# EasyEDA Pro project OURphone_PCB_2026-01-30.epro, schematic OURS PHONE_CONNECTORS_FLIP_2

## Sheets
1 CONNECTORS: Board Name: OURS PHONE_CONNECTORS_FLIP_2; Create Date: 2025-07-15; Page Name: CONNECTORS; Project Name: BackupProjects_abdulrehmanbinafsar_personal_0_20241230; Schematic Name: OURS PHONE_CONNECTORS_FLIP_2; Update Date: 2025-12-22; Add into BOM: yes; Company: Your Company; Convert to PCB: yes; Date: 2024-12-04; Draw By: Abdul Rehman; REV: 1.0; Sheet: 1/1
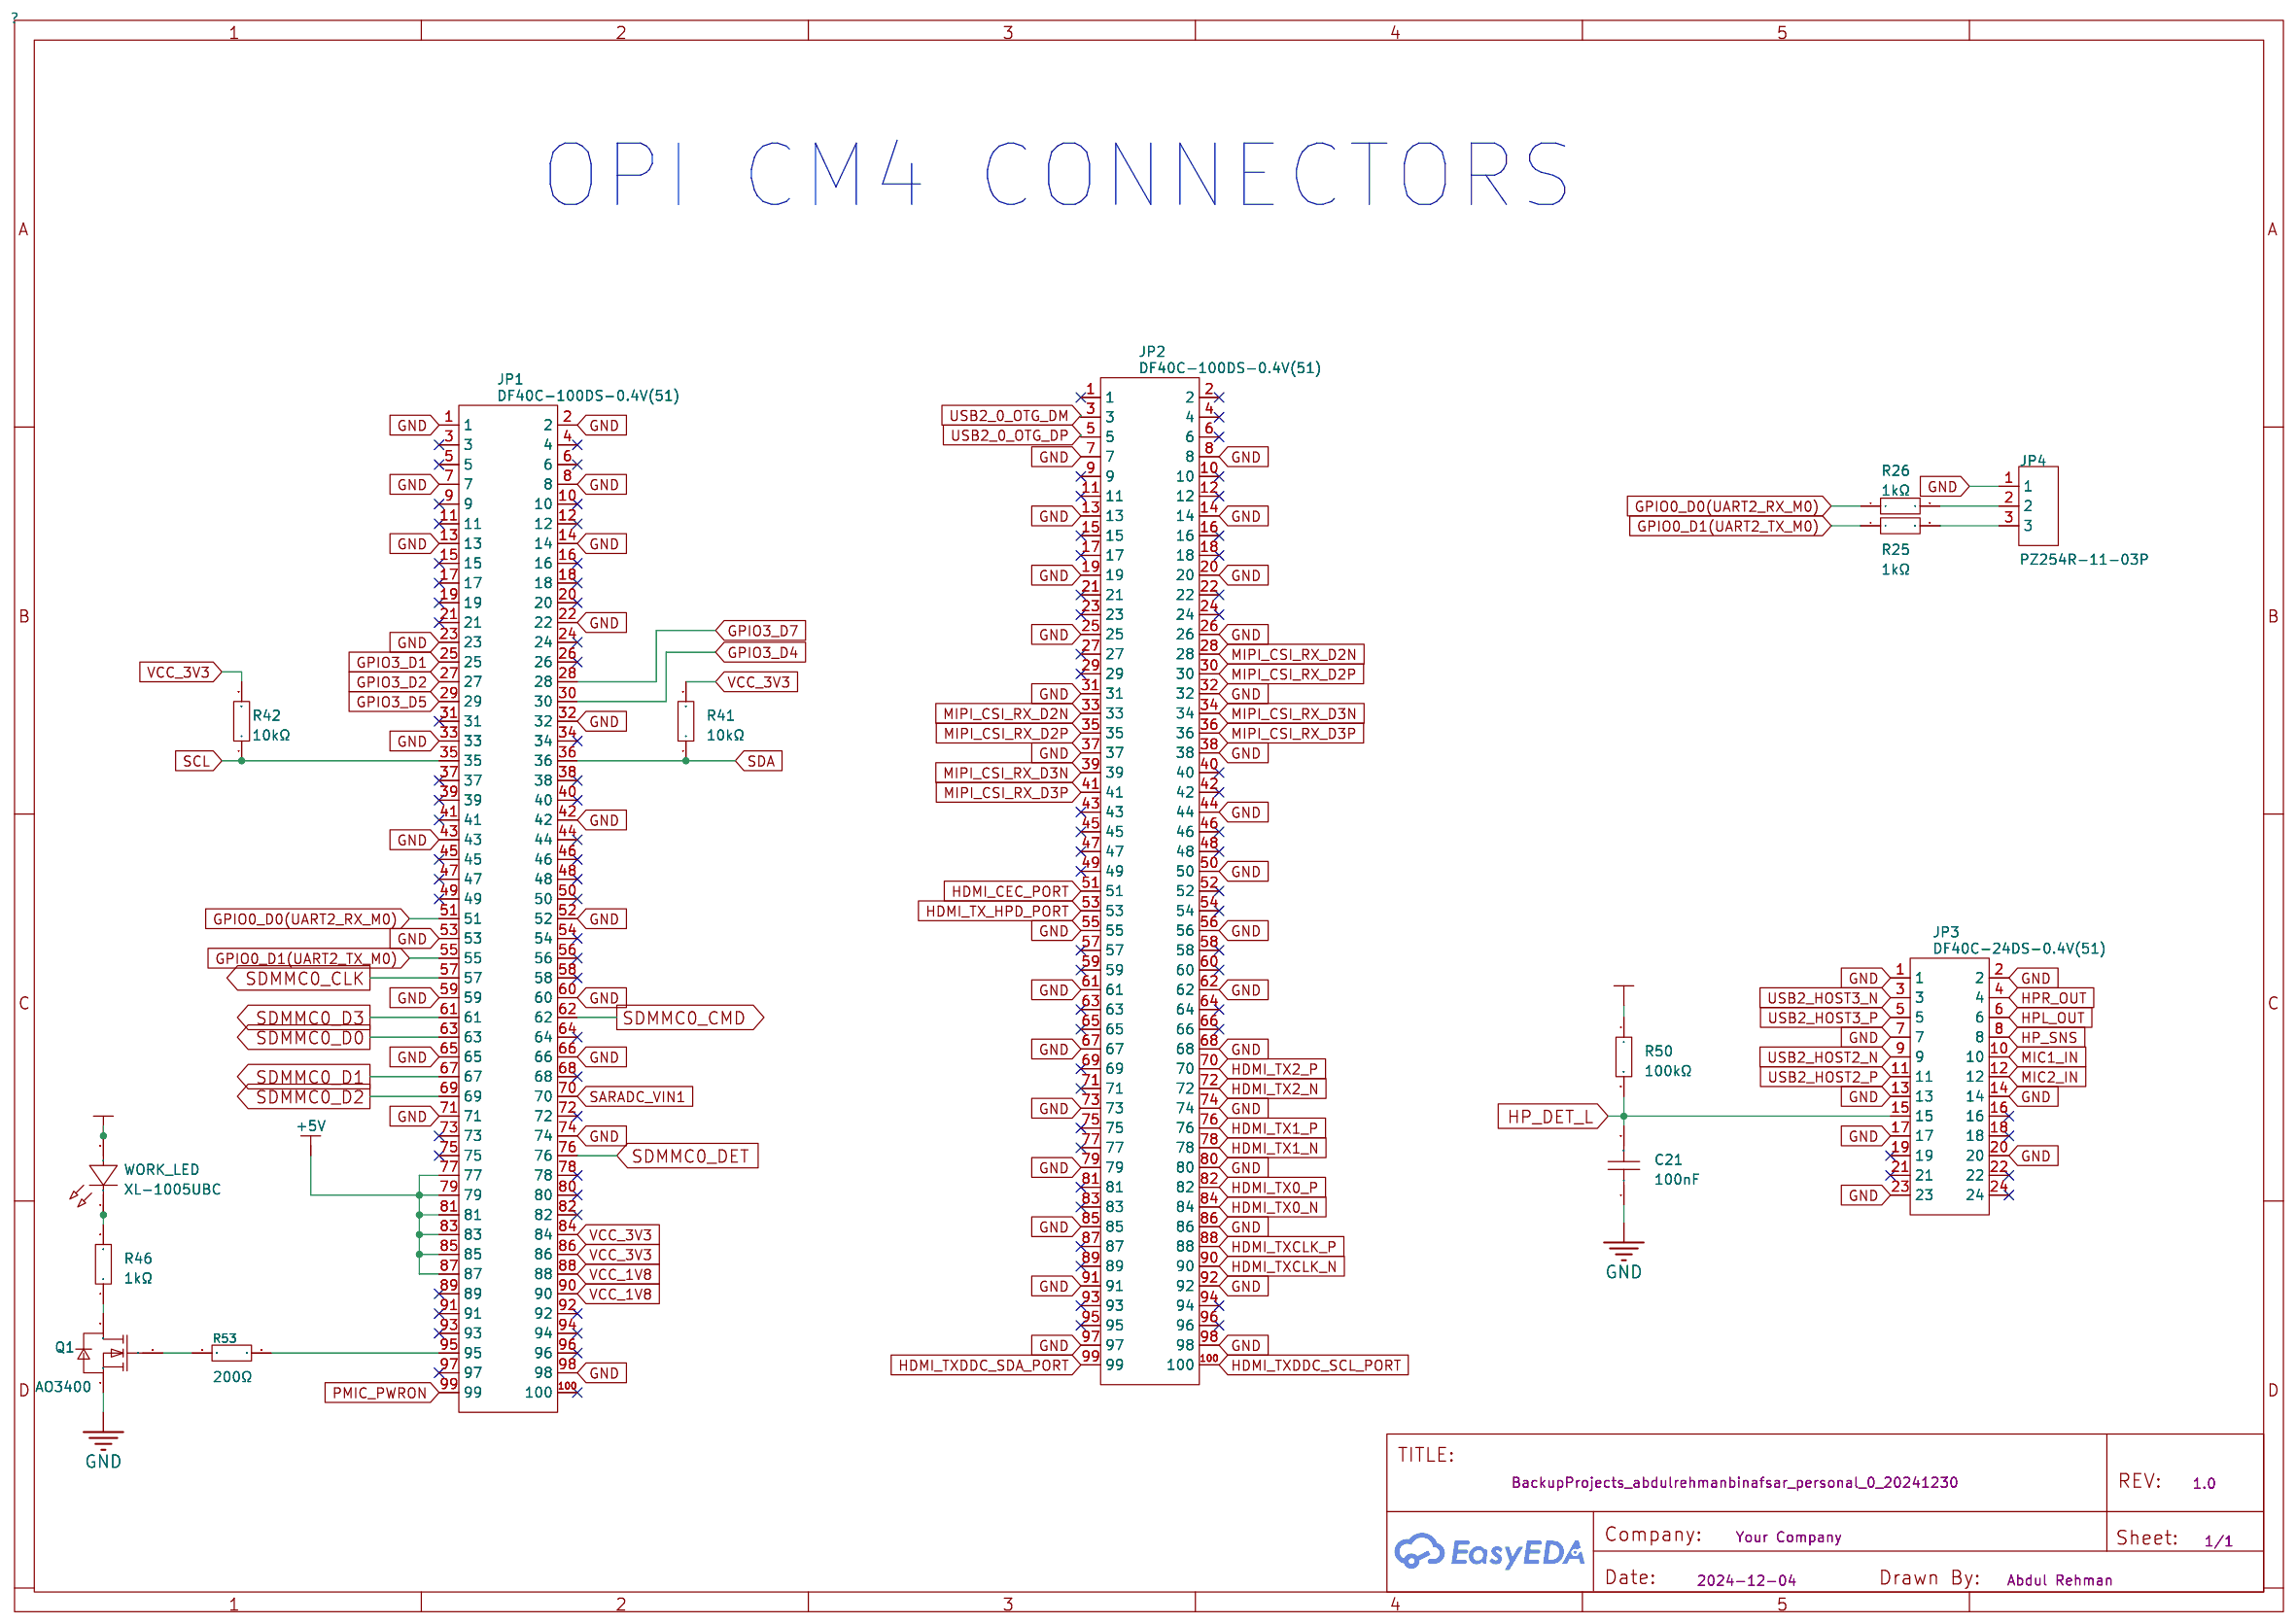
[diagram p0: CONNECTORS]
2 CIRCUITRY: Page Name: CIRCUITRY; Date: 2024-12-06
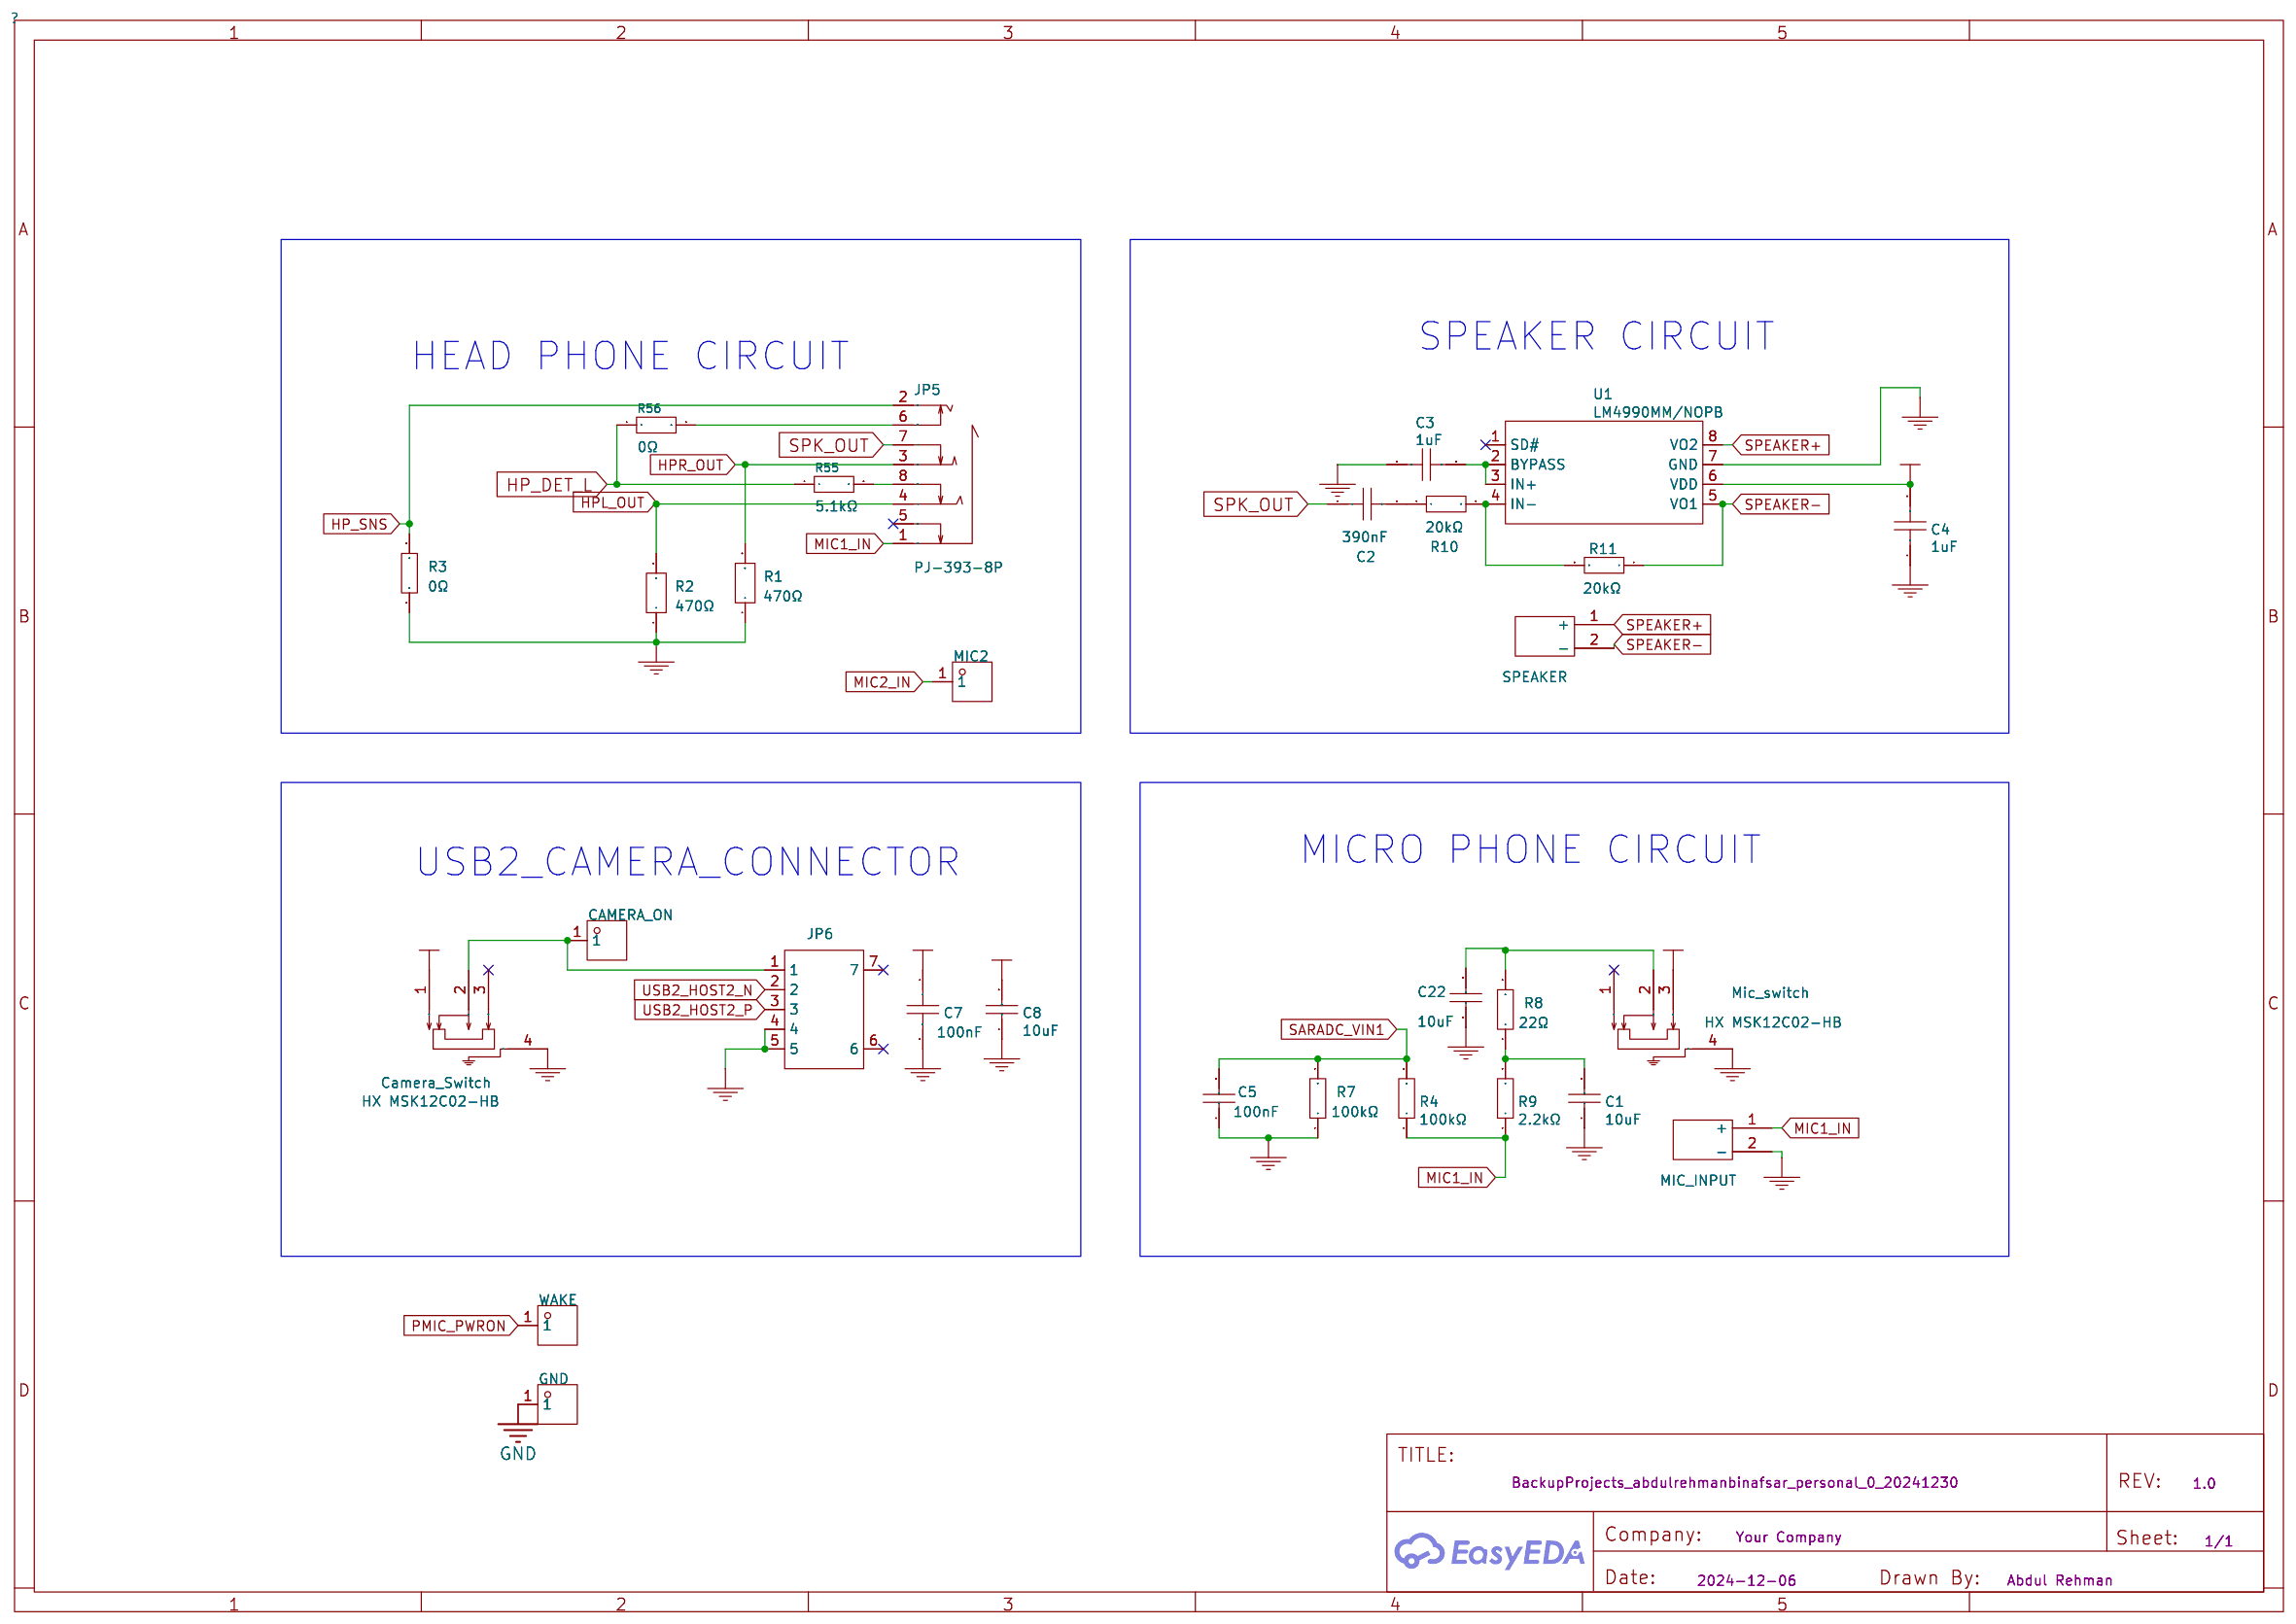
[diagram p1: CIRCUITRY]
3 SIM Module: Page Name: SIM Module; Date: 2024-12-06
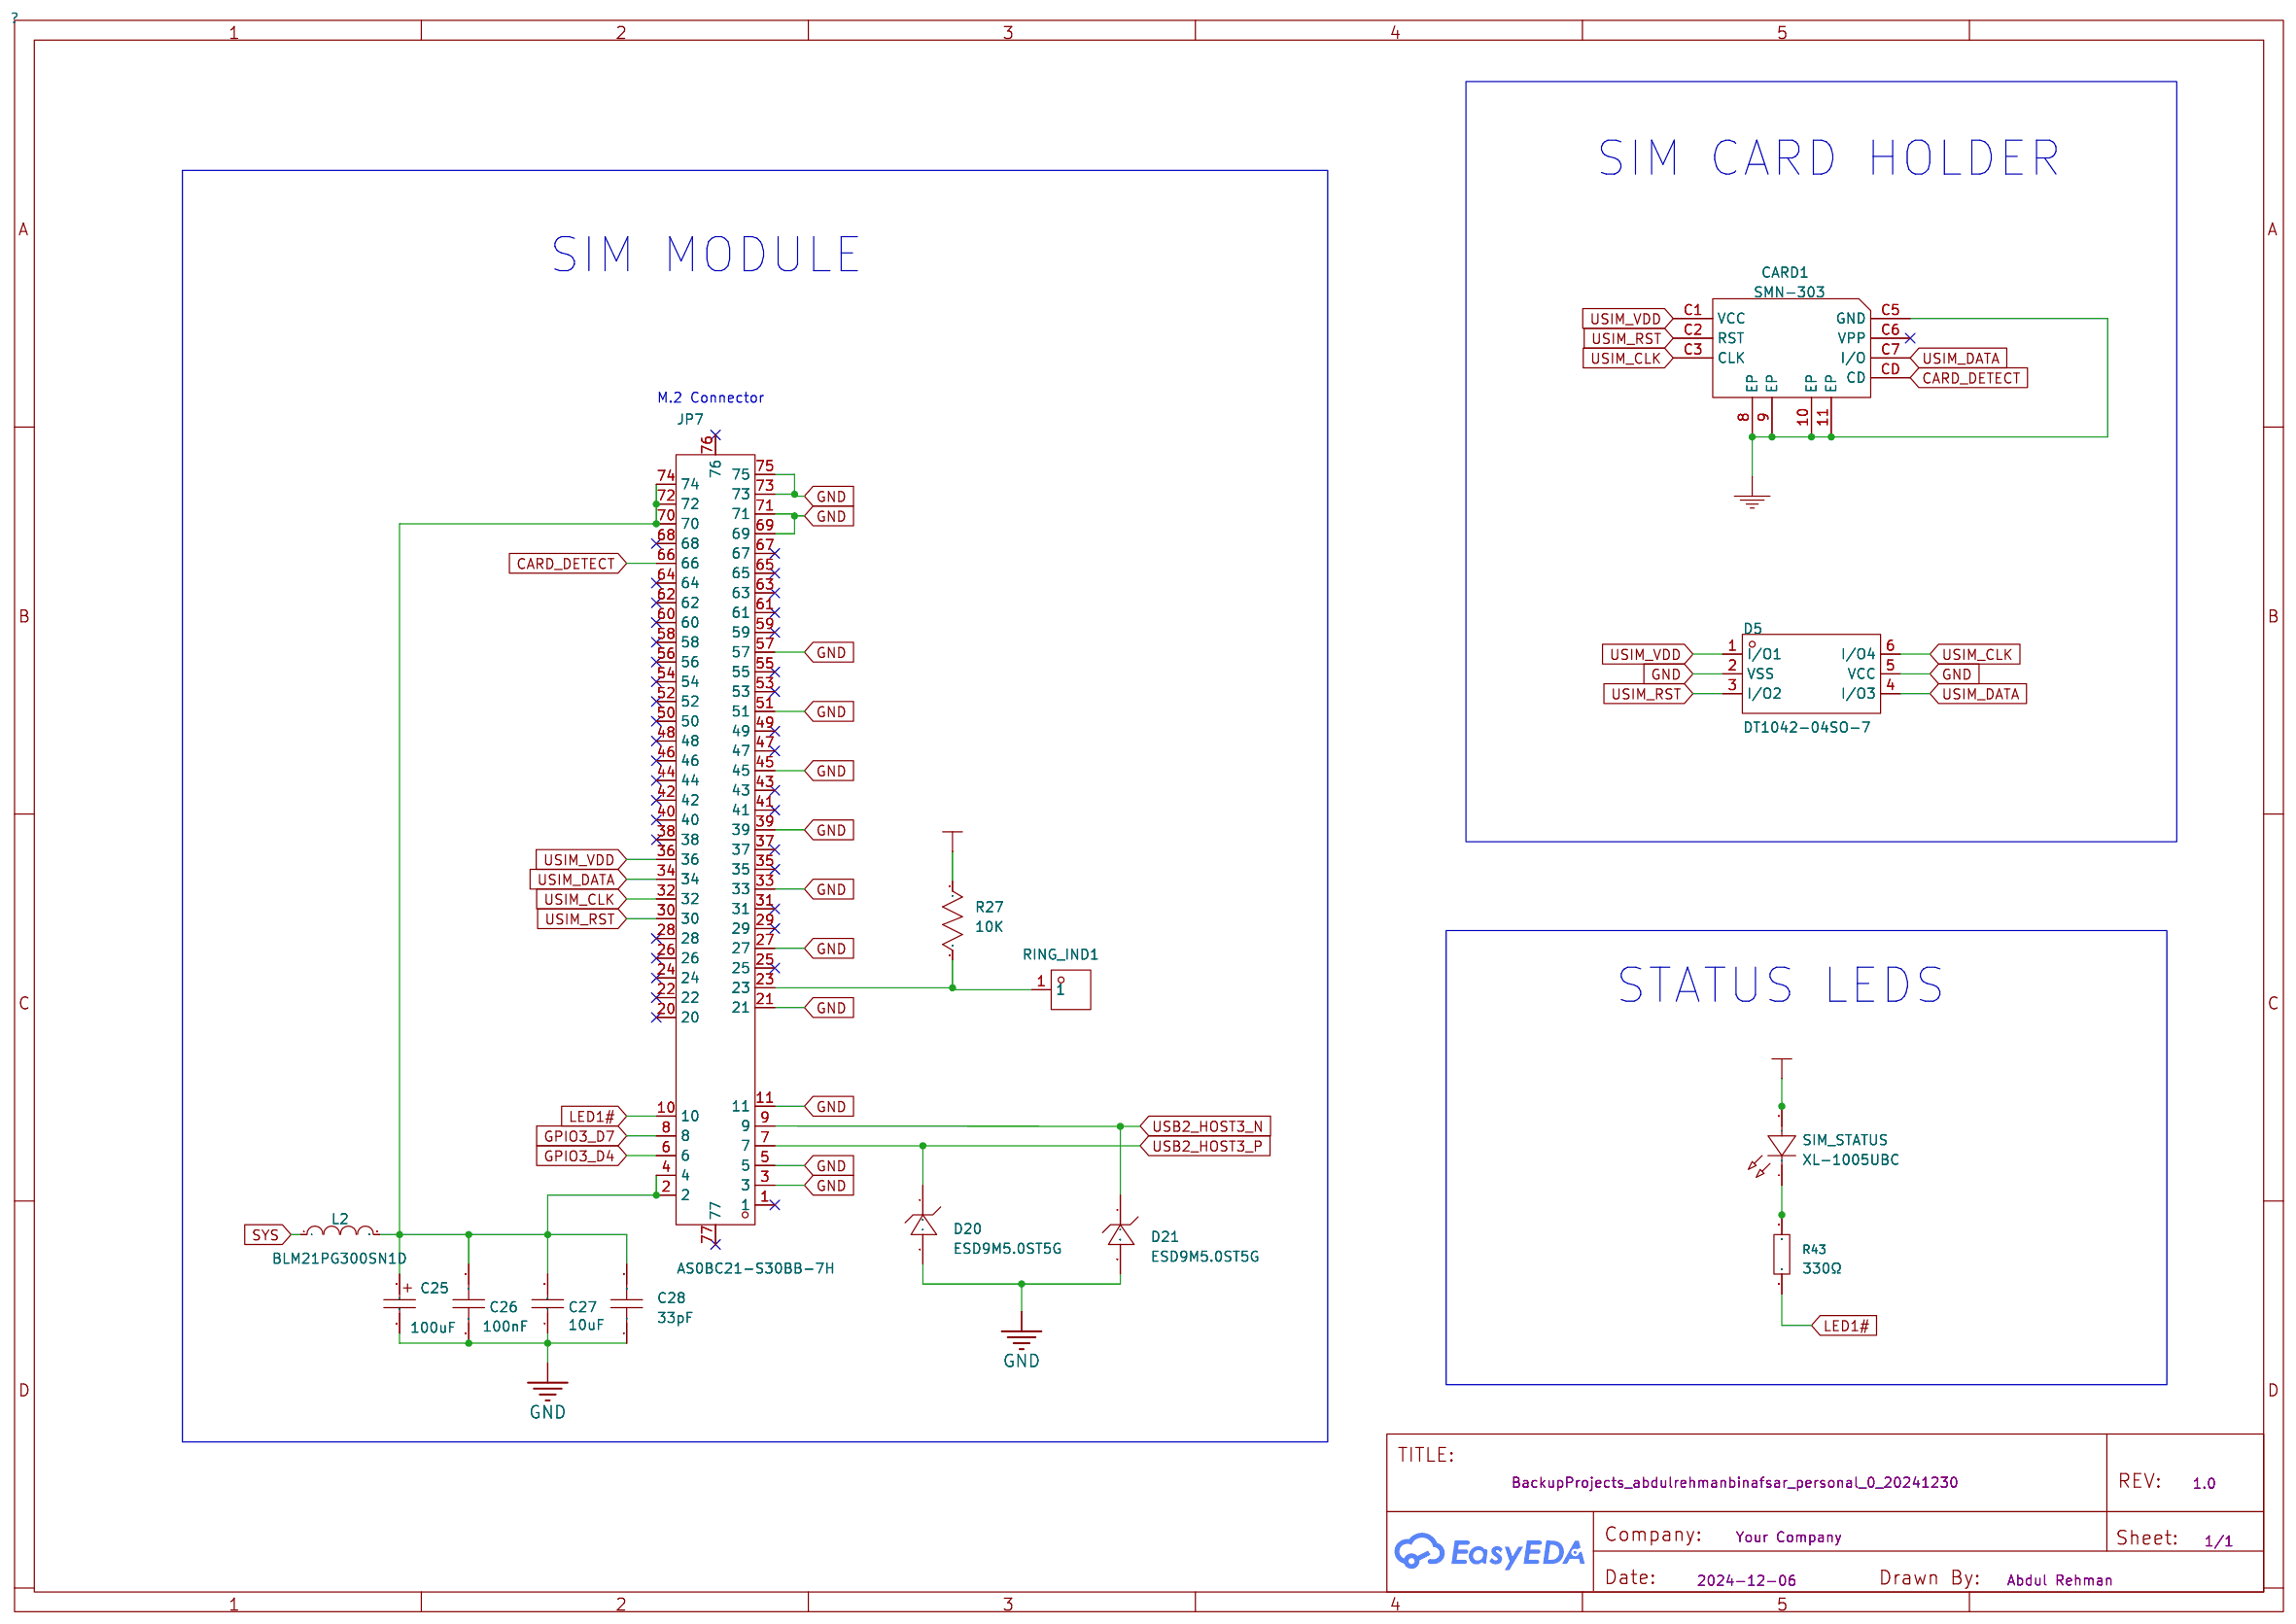
[diagram p2: SIM Module]
4 HDMI PORT: Page Name: HDMI PORT; Update Date: 2025-12-10; Date: 2024-12-09
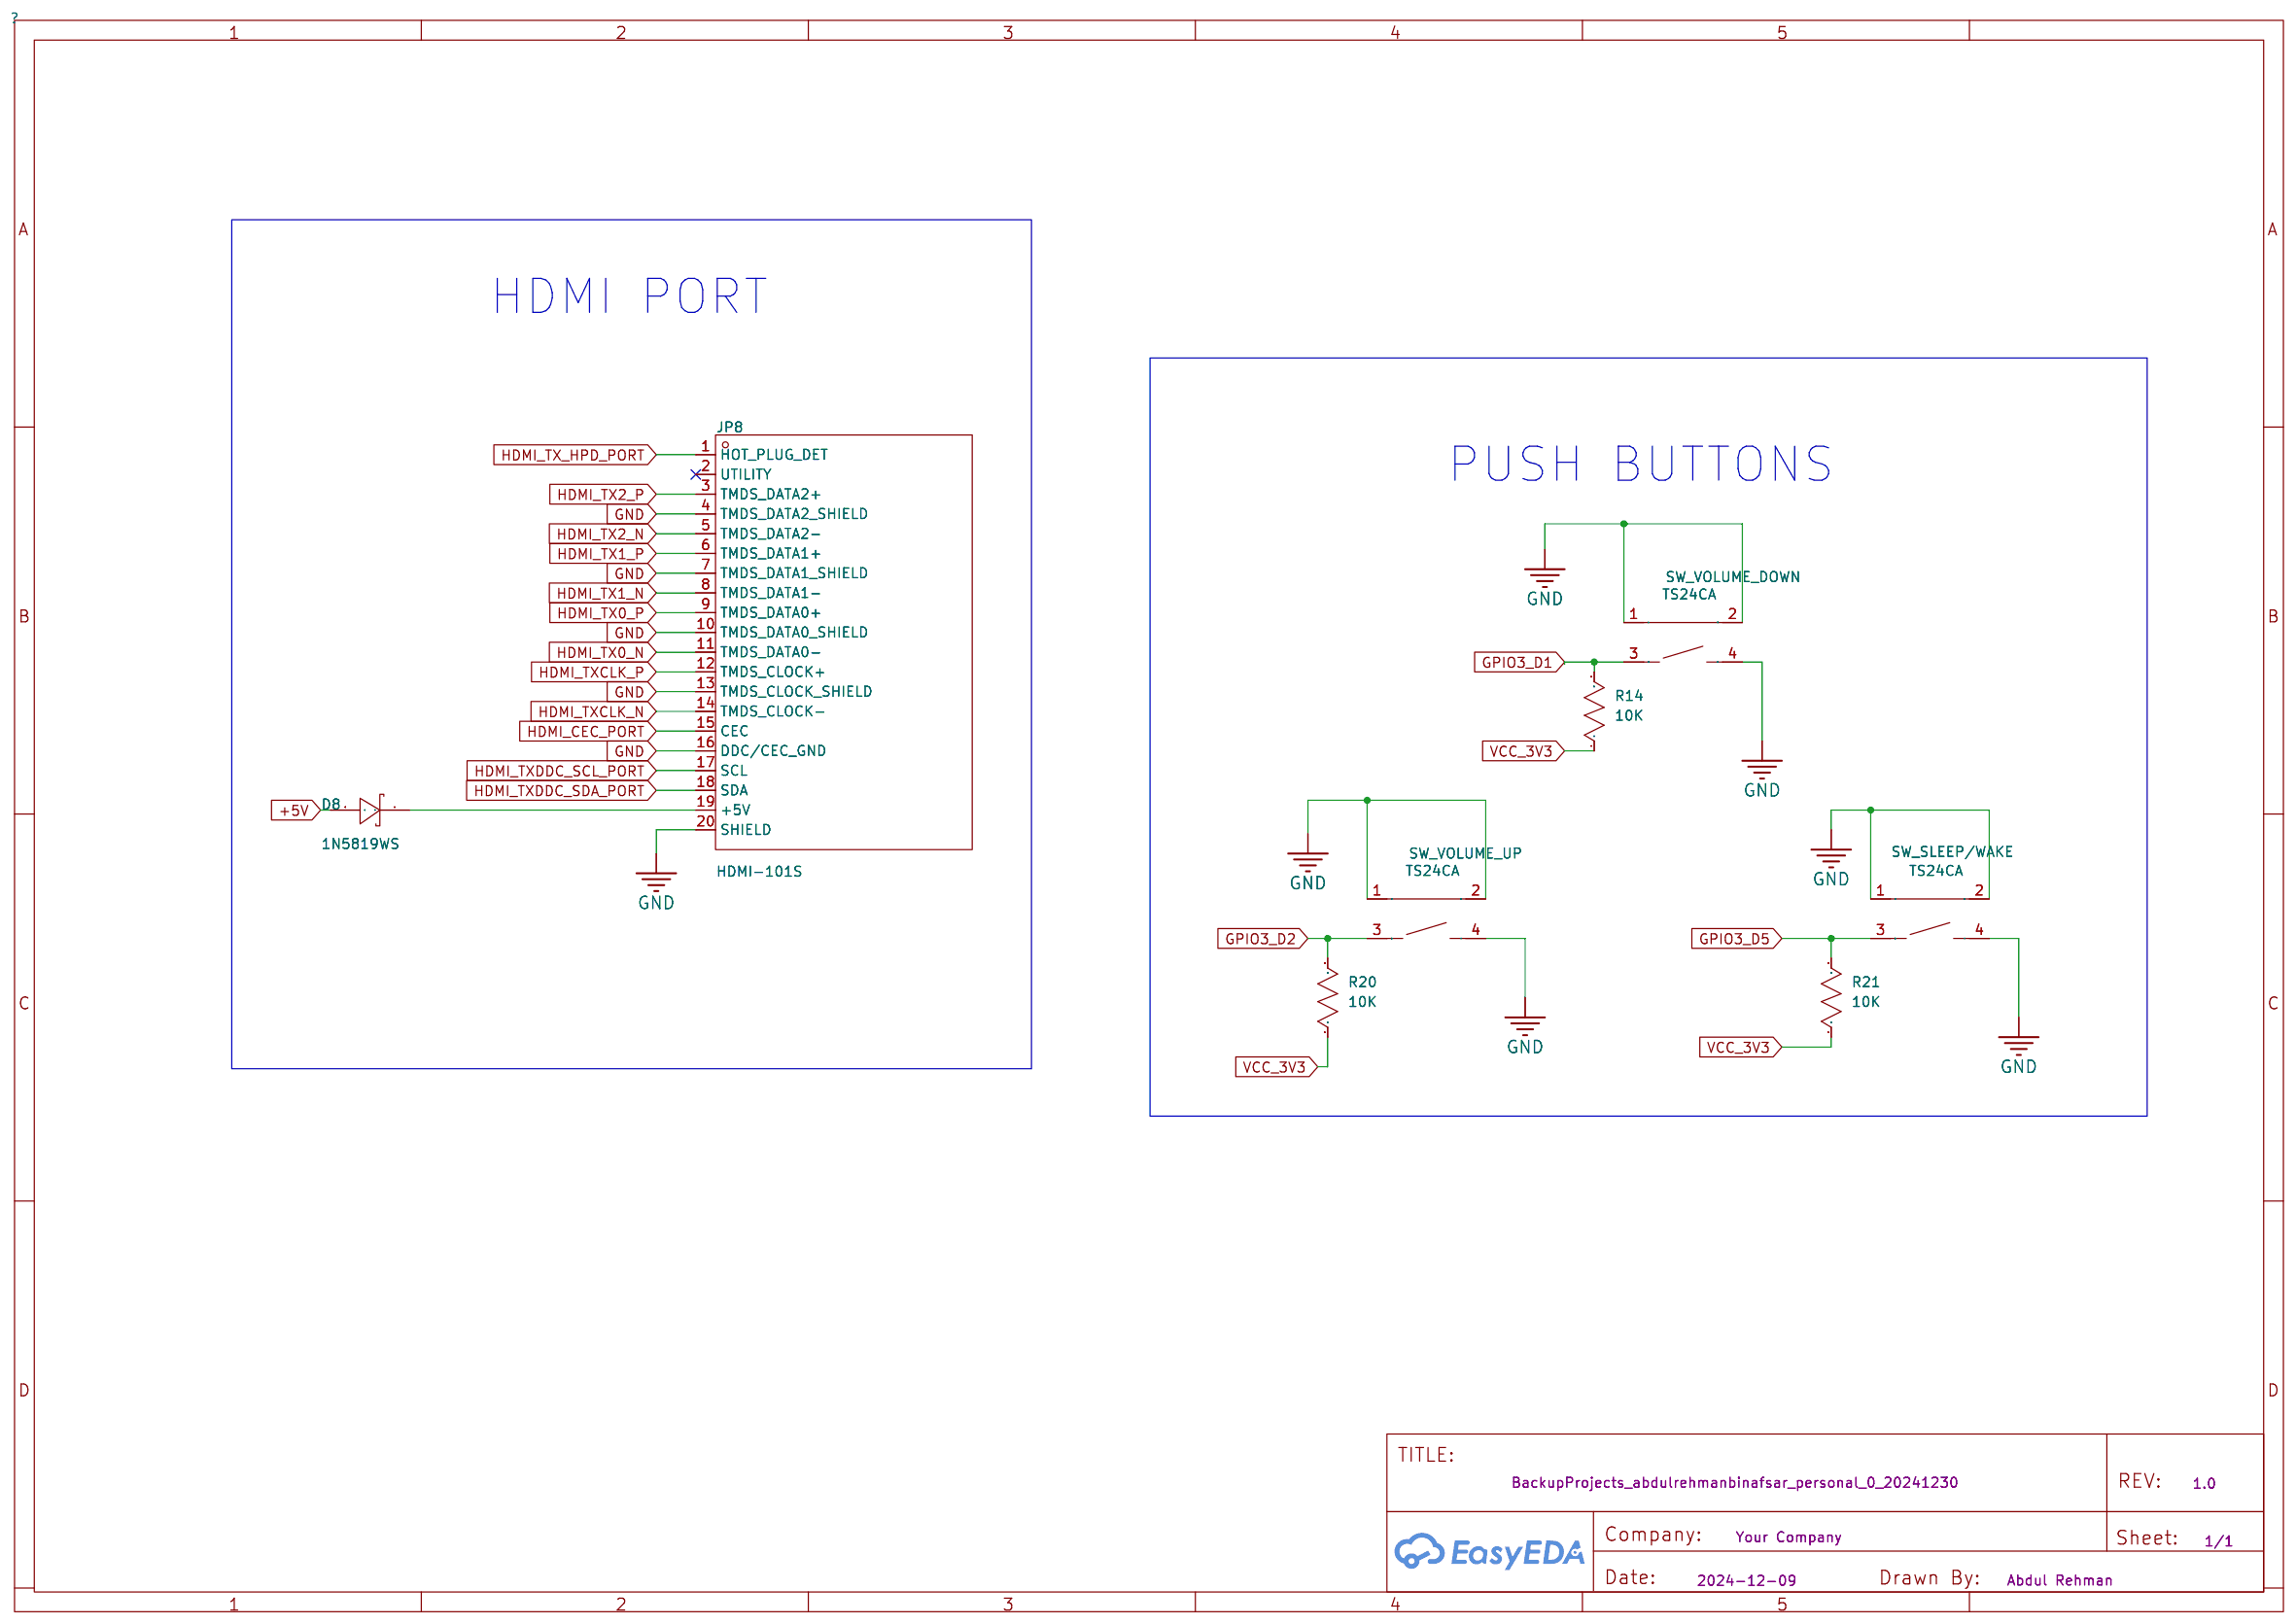
[diagram p3: HDMI PORT]
5 CPBR CIRCUIT: Page Name: CPBR CIRCUIT; Update Date: 2025-12-11; Company: EasyEDA.com; Page Size: A4; Version: V1.0
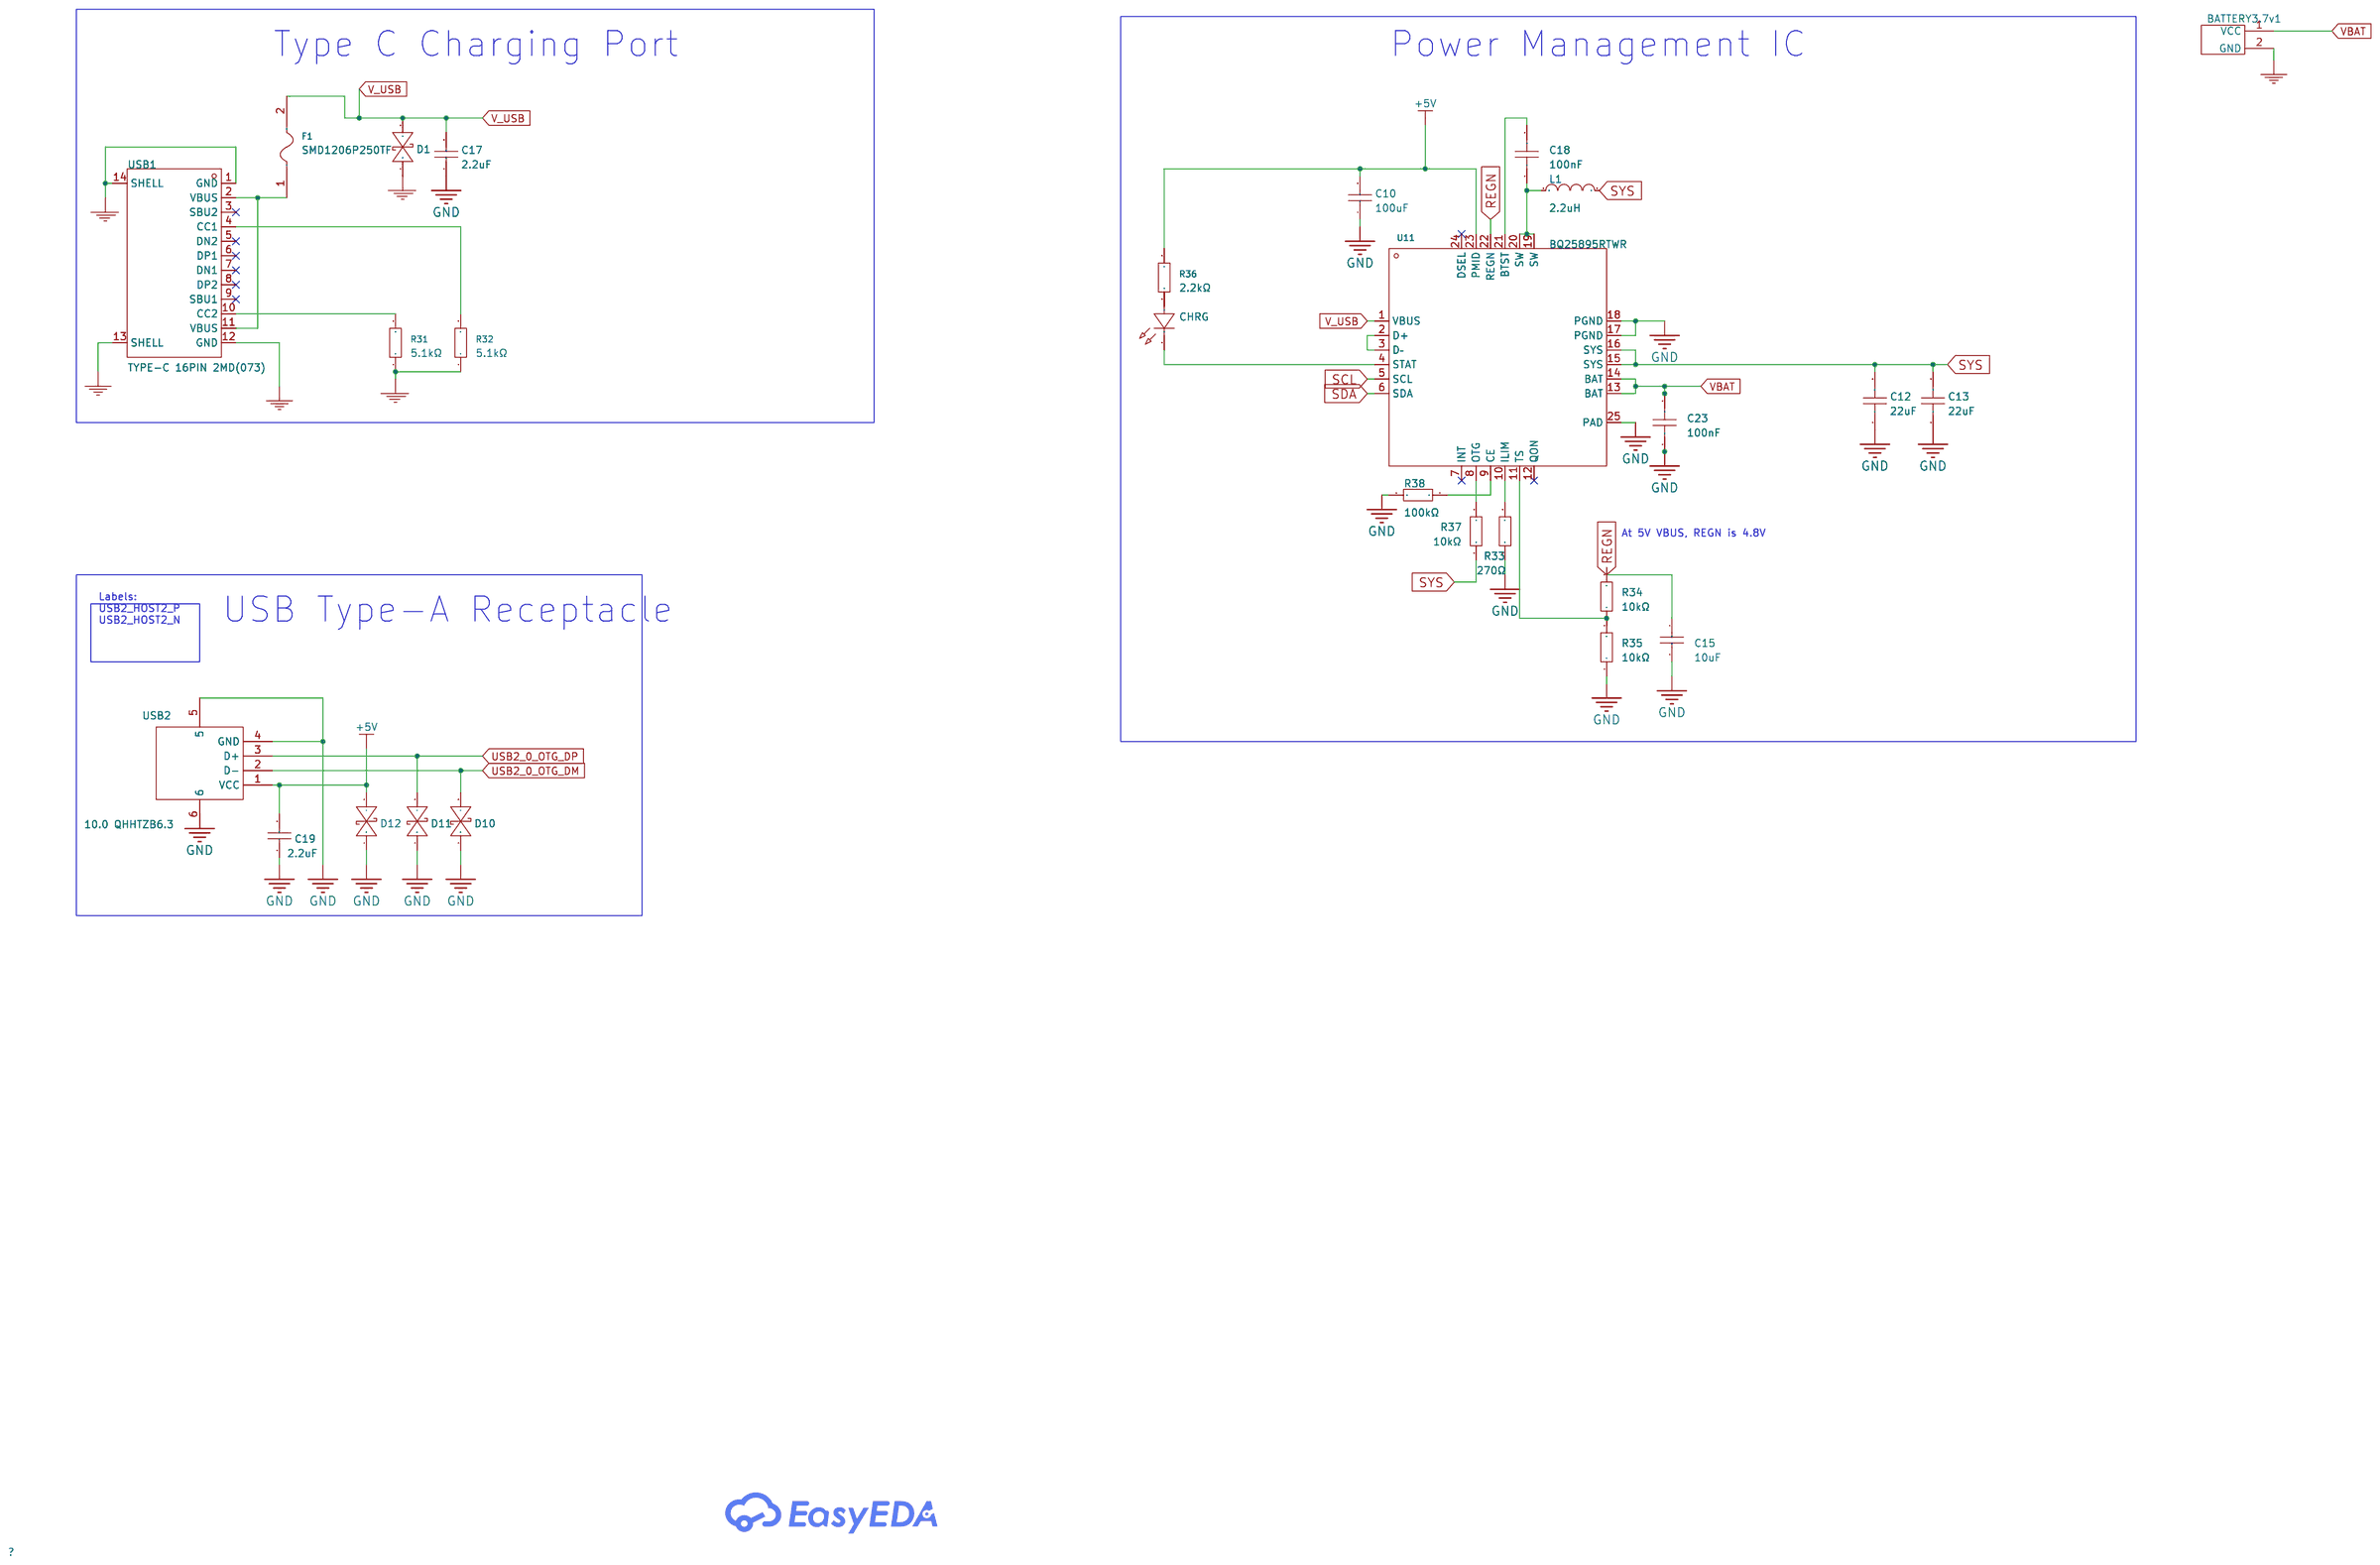
[diagram p4: CPBR CIRCUIT]
6 SD Card: Create Date: 2025-11-14; Page Name: SD Card; Update Date: 2025-12-19; Company: EasyEDA.com; Page Size: A4; Version: V1.0
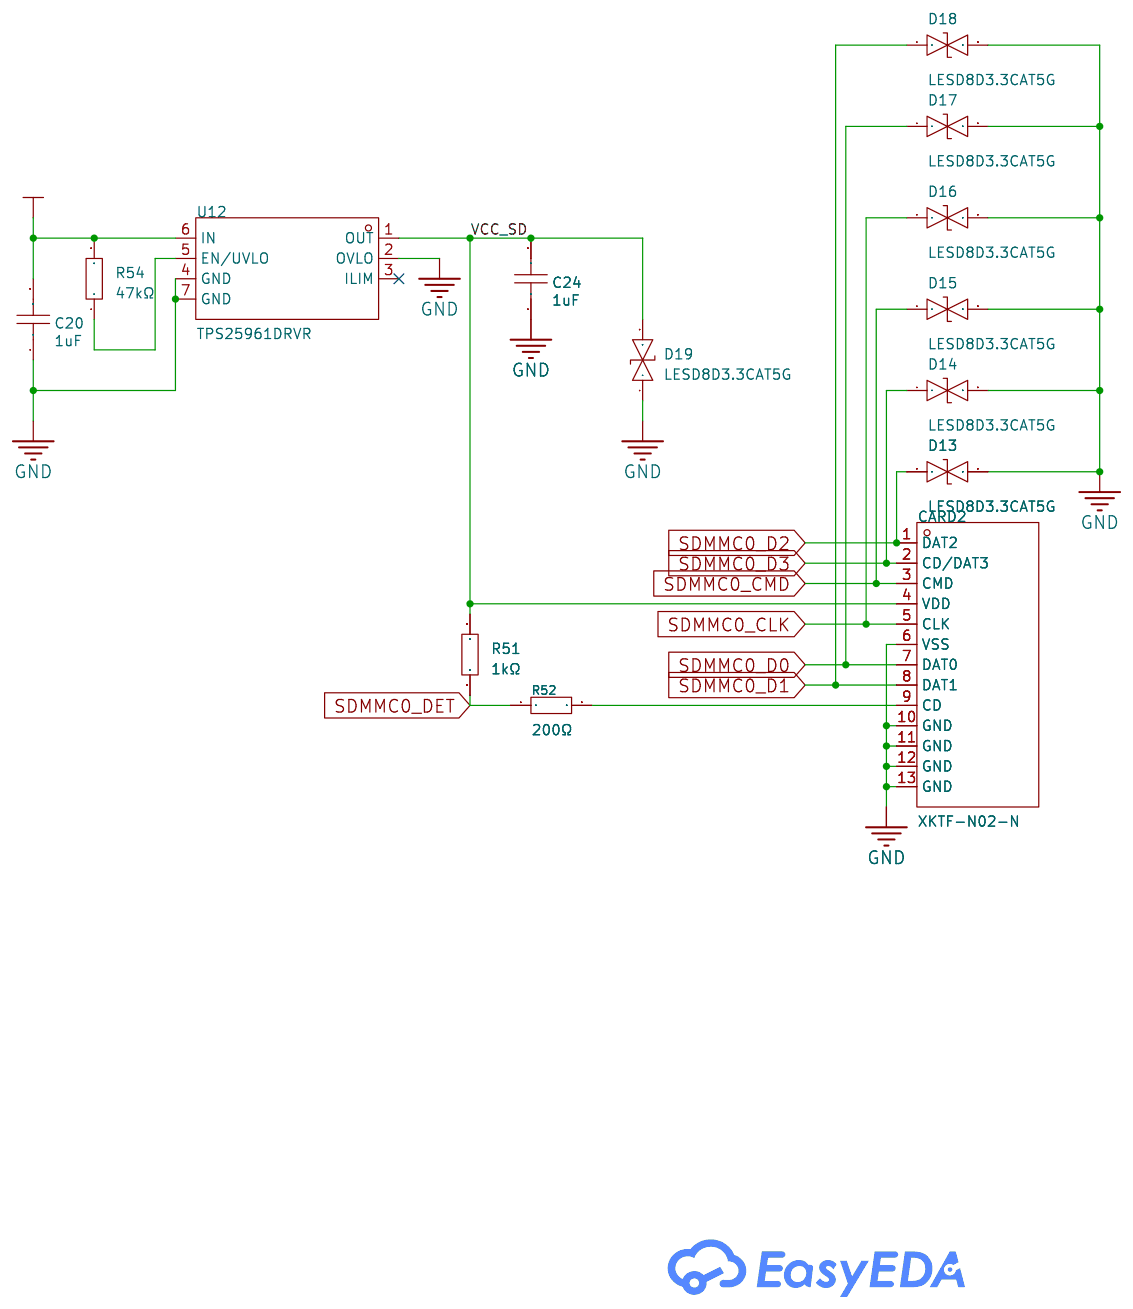
[diagram p5: SD Card]

## Parts
sheet CIRCUITRY
C1  10uF  [C0402]
C2  390nF  [C0402]
C3  1uF  [C0402]
C4  1uF  [C0402]
C5  100nF  [C0402]
C7  100nF  [C0402]
C8  10uF  [C0402]
C22  10uF  [C0402]
CAMERA_ON  TP-橘色测试点  [TESTPOINT-TH_BD3.2]  (no BOM)
Camera_Switch  HX MSK12C02-HB  [SW-SMD_MSK12C02-HB]
GND  TP-橘色测试点  [TESTPOINT-TH_BD3.2]  (no BOM)
JP5  PJ-393-8P  [AUDIO-TH_PJ-393-8P]
JP6  SM05B-SRSS-TB (LF)(SN)  [CONN-SMD_SM05B-SRSS-TB-LF-SN]
MIC2  TP-橘色测试点  [TESTPOINT-TH_BD3.2]  (no BOM)
MIC_INPUT  NOB  [BATTERY SYMBOL]  (no BOM)
Mic_switch  HX MSK12C02-HB  [SW-SMD_MSK12C02-HB]
R1  470Ω  [R0402]
R2  470Ω  [R0402]
R3  0Ω  [R0402]
R4  100kΩ  [R0402]
R7  100kΩ  [R0402]
R8  22Ω  [R0402]
R9  2.2kΩ  [R0402]
R10  20kΩ  [R0402]
R11  20kΩ  [R0402]
R55  5.1kΩ  [R0402]
R56  0Ω  [R0402]  (no BOM)
SPEAKER  NOB  [BATTERY SYMBOL]  (no BOM)
U1  LM4990MM/NOPB  [MSOP-8_L3.0-W3.0-P0.65-LS5.0-BL]
WAKE  TP-橘色测试点  [TESTPOINT-TH_BD3.2]  (no BOM)
sheet CONNECTORS
C21  100nF  [C0402]
JP1  DF40C-100DS-0.4V(51)  [CONN-SMD_DF40C-100DS-0.4V-51]
JP2  DF40C-100DS-0.4V(51)  [CONN-SMD_DF40C-100DS-0.4V-51]
JP3  DF40C-24DS-0.4V(51)  [CONN-SMD_DF40C-24DS-0.4V51]
JP4  PZ254R-11-03P  [HDR-TH_3P-P2.54-H-M-W10.4]
Q1  AO3400  [SOT-23-3_L2.9-W1.3-P1.90-LS2.4-BR]
R25  1kΩ  [R0603]
R26  1kΩ  [R0603]
R41  10kΩ  [R0402]
R42  10kΩ  [R0402]
R46  1kΩ  [R0603]
R50  100kΩ  [R0402]
R53  200Ω  [R0402]
WORK_LED  XL-1005UBC  [LED0402-RD]
sheet CPBR CIRCUIT
BATTERY3.7v1  NOB  [BATTERY SYMBOL]  (no BOM)
C10  100uF  [C1206]
C12  22uF  [C0805]
C13  22uF  [C0805]
C15  10uF  [C0402]
C17  2.2uF  [C0805]
C18  100nF  [C0402]
C19  2.2uF  [C0805]
C23  100nF  [C0402]
CHRG  XL-1005UGC  [LED0402-RD_GREEN]
D1  AZ5825-01F  [DFN-2L_L1.0-W0.6-P0.65-BI]
D10  AZ5825-01F  [DFN-2L_L1.0-W0.6-P0.65-BI]
D11  AZ5825-01F  [DFN-2L_L1.0-W0.6-P0.65-BI]
D12  AZ5825-01F  [DFN-2L_L1.0-W0.6-P0.65-BI]
F1  SMD1206P250TF  [F1206]
L1  2.2uH  [IND-SMD_L4.4-W4.2]
R31  5.1kΩ  [R0402]
R32  5.1kΩ  [R0402]
R33  270Ω  [R0402]
R34  10kΩ  [R0402]
R35  10kΩ  [R0402]
R36  2.2kΩ  [R0402]
R37  10kΩ  [R0402]
R38  100kΩ  [R0402]
U11  BQ25895RTWR  [QFN-24_L4.0-W4.0-P0.50-TL-EP2.7]
USB1  TYPE-C 16PIN 2MD(073)  [USB-C-SMD_TYPE-C-6PIN-2MD-073]
USB2  10.0 QHHTZB6.3  [USB-A-TH_10.0QHHTZB6.3]
sheet HDMI PORT
D8  1N5819WS  [SOD-323_L1.8-W1.3-LS2.5-RD]
JP8  HDMI-101S  [HDMI-SMD_HDMI-101S]
R14  10K  [R0603]
R20  10K  [R0603]
R21  10K  [R0603]
SW_SLEEP/WAKE  TS24CA  [SW-SMD_TS24CA]
SW_VOLUME_DOWN  TS24CA  [SW-SMD_TS24CA]
SW_VOLUME_UP  TS24CA  [SW-SMD_TS24CA]
sheet SD Card
C20  1uF  [C0402]
C24  1uF  [C0402]
CARD2  XKTF-N02-N  [TF-SMD_XKTF-N02-N]
D13  LESD8D3.3CAT5G  [SOD-882_L1.0-W0.6-BI]
D14  LESD8D3.3CAT5G  [SOD-882_L1.0-W0.6-BI]
D15  LESD8D3.3CAT5G  [SOD-882_L1.0-W0.6-BI]
D16  LESD8D3.3CAT5G  [SOD-882_L1.0-W0.6-BI]
D17  LESD8D3.3CAT5G  [SOD-882_L1.0-W0.6-BI]
D18  LESD8D3.3CAT5G  [SOD-882_L1.0-W0.6-BI]
D19  LESD8D3.3CAT5G  [SOD-882_L1.0-W0.6-BI]
R51  1kΩ  [R0402]
R52  200Ω  [R0402]
R54  47kΩ  [R0402]
U12  TPS25961DRVR  [WSON-6_L2.0-W2.0-P0.65-TL-EP]
sheet SIM Module
C25  100uF  [CASE-B_3528]
C26  100nF  [C0402]
C27  10uF  [C0402]
C28  33pF  [C0402]
CARD1  SMN-303  [SIM-SMD_SMN-303]
D5  DT1042-04SO-7  [SOT-26_L3.0-W1.6-P0.95-LS2.8-BL]
D20  ESD9M5.0ST5G  [SOD-923_L0.8-W0.6-LS1.0-RD]
D21  ESD9M5.0ST5G  [SOD-923_L0.8-W0.6-LS1.0-RD]
JP7  AS0BC21-S30BB-7H  [CONN-SMD_AS0BC21-S30BB-7H]
L2  BLM21PG300SN1D  [L0805]
R27  10K  [R0603]
R43  330Ω  [R0805]
RING_IND1  TP-橘色测试点  [TESTPOINT-TH_BD3.2]  (no BOM)
SIM_STATUS  XL-1005UBC  [LED0402-RD]

## Library data of the parts
C1 C8 C27 = 10uF: Supplier: LCSC; Manufacturer: YAGEO(国巨); Manufacturer Part: CL05A106MQ5NUNC; Supplier Part: C15525; JLCPCB Part Class: Extended Part; Check: true
C2 = 390nF: Supplier: LCSC; Supplier Part: C7393858; Manufacturer: CCTC(三环); Manufacturer Part: TCC0402X5R394K160AT; JLCPCB Part Class: Extended Part; Check: true
C3 C4 C20 C24 = 1uF: Supplier: LCSC; Supplier Part: C318573; Manufacturer: SAMSUNG(三星); Manufacturer Part: CL05A105MQ5NNNC; JLCPCB Part Class: Extended Part; Check: true
C5 = 100nF: Supplier: LCSC; Supplier Part: C106204; Manufacturer: YAGEO(国巨); Manufacturer Part: CC0402KRX5R7BB104; JLCPCB Part Class: Extended Part; Check: true
C7 C26 = 100nF: Supplier: LCSC; Supplier Part: C576741; Manufacturer: YAGEO(国巨); Manufacturer Part: CC0402MRX5R7BB104; JLCPCB Part Class: Extended Part; Check: true
C15 C22 = CL05A106MQ5NUNC: Capacitance:10uF Tolerance:±20% Tolerance:±20% Voltage Rating:6.3V Temperature Coefficient:X5R; LCSC Part Name: 10uF ±20% 6.3V; Supplier Part: C15525; Manufacturer: SAMSUNG(三星); Supplier Footprint: 0402; JLCPCB Part Class: Basic Part; Datasheet: https://item.szlcsc.com/datasheet/CL05A106MQ5NUNC/16204.html; Supplier: LCSC; Tolerance: ±20%; Voltage Rating: 6.3V; Temperature Coefficient: X5R
CAMERA_ON GND MIC2 RING_IND1 WAKE = TP-橘色测试点: Supplier Part: C9900007421; Supplier Footprint: TESTPOINT-TH_BD-2P-P2.00; JLCPCB Part Class: Extended Part; Supplier: LCSC; Check: true
Camera_Switch Mic_switch = HX MSK12C02-HB: Supplier: LCSC; Supplier Part: C5149817; Manufacturer: hanxia(韩下); JLCPCB Part Class: Extended Part; Check: true
JP5 = PJ-393-8P: Connector Type:3.5mm Headphone Jack Current Rating:1A Voltage Rating (Max):20V Contact Material:Phosphor Bronze Contact Plating:Gold Operating Temperature:-20℃~+70℃ Operating Temperature:-20℃~+70℃; LCSC Part Name: 3.5mm耳机座; Supplier Part: C5155561; Manufacturer: G-Switch(品赞); Supplier Footprint: SMD; JLCPCB Part Class: Extended Part; Datasheet: https://item.szlcsc.com/datasheet/PJ-393-8P/5785314.html; Supplier: LCSC; Connector Type: 3.5mm Headphone Jack; Current Rating: 1A; Voltage Rating (Max): 20V; Contact Material: Phosphor Bronze; Contact Plating: Gold; Operating Temperature: -20℃~+70℃
JP6 = SM05B-SRSS-TB (LF)(SN): Supplier: LCSC; Supplier Part: C136657; Manufacturer: JST; Manufacturer Part: SM05B-SRSS-TB(LF)(SN); JLCPCB Part Class: Extended Part; Check: true
BATTERY3.7v1 MIC_INPUT SPEAKER = NOB: Check: true
R1 R2 = 470Ω: Supplier: LCSC; Supplier Part: C881295; Manufacturer: EVER OHMS(天二科技); Manufacturer Part: CR0402J470RQ10Z; JLCPCB Part Class: Extended Part; Check: true
R3 = 0Ω: Supplier: LCSC; Supplier Part: C17168; Manufacturer: UNI-ROYAL(Uniroyal Elec); Manufacturer Part: 0402WGF0000TCE; JLCPCB Part Class: Extended Part; Check: true
R4 R7 = 100kΩ: Supplier: LCSC; Manufacturer: YAGEO(国巨); Manufacturer Part: AC0402JR-07100KL; Supplier Part: C144732; JLCPCB Part Class: Extended Part; Check: true
R8 = 22Ω: Supplier: LCSC; Supplier Part: C25092; Manufacturer: UNI-ROYAL(Uniroyal Elec); Manufacturer Part: 0402WGF220JTCE; JLCPCB Part Class: Extended Part; Check: true
R9 = 2.2kΩ: Supplier: LCSC; Supplier Part: C269678; Manufacturer: Tyohm(幸亚电阻); Manufacturer Part: RMC04022.2K5%N; JLCPCB Part Class: Extended Part; Check: true
R10 R11 = 20kΩ: Supplier: LCSC; Manufacturer: YAGEO(国巨); Manufacturer Part: RC0402FR-0720KL; Supplier Part: C93942; JLCPCB Part Class: Extended Part; Check: true
R31 R32 R55 = 0402WGF5101TCE: Type:Thick Film Resistor Resistance:5.1kΩ Tolerance:±1% Tolerance:±1% Power(Watts):62.5mW Voltage-Supply(Max):50V Temperature Coefficient:±100ppm/℃ Temperature Coefficient:±100ppm/℃ Operating Temperature:-55℃~+155℃ Operating Temperature:-55℃~+155℃; LCSC Part Name: 5.1kΩ ±1% 62.5mW 厚膜电阻; Supplier Part: C25905; Manufacturer: UNI-ROYAL(厚声); Supplier Footprint: 0402; JLCPCB Part Class: Basic Part; Datasheet: https://item.szlcsc.com/datasheet/0402WGF5101TCE/26648.html; Supplier: LCSC; Type: Thick Film Resistor; Tolerance: ±1%; Power(Watts): 62.5mW; Voltage-Supply(Max): 50V; Temperature Coefficient: ±100ppm/℃; Operating Temperature: -55℃~+155℃
R56 = 0402WGF0000TCE: Type:Thick Film Resistor Resistance:0Ω Tolerance:±1% Tolerance:±1% Power(Watts):62.5mW Voltage-Supply(Max):50V Temperature Coefficient:±800ppm/℃ Temperature Coefficient:±800ppm/℃ Operating Temperature:-55℃~+155℃ Operating Temperature:-55℃~+155℃; LCSC Part Name: 0Ω ±1% 62.5mW 厚膜电阻; Supplier Part: C17168; Manufacturer: UNI-ROYAL(厚声); Supplier Footprint: 0402; JLCPCB Part Class: Basic Part; Datasheet: https://item.szlcsc.com/datasheet/0402WGF0000TCE/17853.html; Supplier: LCSC; Type: Thick Film Resistor; Tolerance: ±1%; Power(Watts): 62.5mW; Voltage-Supply(Max): 50V; Temperature Coefficient: ±800ppm/℃; Operating Temperature: -55℃~+155℃
U1 = LM4990MM/NOPB: Supplier: LCSC; Manufacturer: TI(德州仪器); Supplier Part: C8958; JLCPCB Part Class: Extended Part; Check: true
C18 C21 C23 = CL05B104KO5NNNC: Capacitance: Tolerance:±10% Tolerance:±10% Voltage Rated: Temperature Coefficient:; LCSC Part Name: 100nF ±10% 16V; Supplier Part: C1525; Manufacturer: SAMSUNG(三星); Supplier Footprint: 0402; JLCPCB Part Class: Basic Part; Datasheet: https://atta.szlcsc.com/upload/public/pdf/source/20160218/1457707763339.pdf; Supplier: LCSC; Tolerance: ±10%
JP1 JP2 = DF40C-100DS-0.4V(51): Supplier: LCSC; Supplier Part: C597931; Manufacturer: HRS(广濑); JLCPCB Part Class: Extended Part; Check: true
JP3 = DF40C-24DS-0.4V(51): Supplier: LCSC; Supplier Part: C424640; Manufacturer: HRS(广濑); JLCPCB Part Class: Extended Part; Check: true
JP4 = PZ254R-11-03P: Pin Structure:1x3P Pitch:2.54mm Row Spacing:- Circluar Pins/Square Pins:Policy Mounting Type:Right-Angle Number of Rows:Single Row Number of Pins:3P Current Rating:- Voltage Rating (Max):- Length of Mating Pin:6mm Insulation Height:2.5mm Contact Material:; LCSC Part Name: 1x3P 间距:2.54mm 方针 弯插; Supplier Part: C492411; Manufacturer: XFCN(兴飞); Supplier Footprint: 弯插,P=2.54mm; JLCPCB Part Class: Extended Part; Datasheet: https://atta.szlcsc.com/upload/public/pdf/source/20200309/C492411_5256E8AAA7569F6D33B6ADBFAE4F2888.pdf; Supplier: LCSC; Pin Structure: 1x3P; Pitch: 2.54mm; Circluar Pins/Square Pins: Policy; Mounting Type: Right-Angle; Number of Rows: Single Row; Number of Pins: 3P; Length of Mating Pin: 6mm; Insulation Height: 2.5mm; Contact Material: Brass; Operating Temperature: -40℃~+105℃; Color: Black; Check: true
Q1 = AO3400_C22751456: Drain to Source Voltage:30V Current - Continuous Drain(Id):5.7A RDS(on):26.5mΩ@10V Pd - Power Dissipation:1.4W Gate Threshold Voltage (Vgs(th)):1.05V@250uA Gate Charge(Qg):6nC@4.5V Input Capacitance(Ciss):630pF Reverse Transfer Capacitance (Crss@Vds):50pF; LCSC Part Name: 场效应管(MOSFET); Supplier Part: C22751456; Manufacturer: ALJ(龙晶微); Supplier Footprint: SOT-23; JLCPCB Part Class: Extended Part; Datasheet: https://item.szlcsc.com/datasheet/AO3400/24477109.html; Supplier: LCSC; Drain to Source Voltage: 30V; Current - Continuous Drain(Id): 5.7A; RDS(on): 26.5mΩ@10V; Pd - Power Dissipation: 1.4W; Gate Threshold Voltage (Vgs(th)): 1.05V@250uA; Gate Charge(Qg): 6nC@4.5V; Input Capacitance(Ciss): 630pF; Reverse Transfer Capacitance (Crss@Vds): 50pF; Type: N-Channel; Output Capacitance(Coss): 75pF
R25 R26 R46 = 0603WAF1001T5E: Type:Thick Film Resistors Resistance:1kΩ Tolerance:±1% Tolerance:±1% Power(Watts): Overload Voltage (Max): Temperature Coefficient:±100ppm/℃ Temperature Coefficient:±100ppm/℃ Operating Temperature Range:-55℃~+155℃ Operating Temperature Range:-55℃~+155℃; LCSC Part Name: 1kΩ ±1% 100mW 厚膜电阻; Supplier Part: C21190; Manufacturer: UNI-ROYAL(厚声); Supplier Footprint: 0603; JLCPCB Part Class: Basic Part; Datasheet: https://atta.szlcsc.com/upload/public/pdf/source/20200306/C422600_1E6D84923E4A46A82E41ADD87F860B5C.pdf; Supplier: LCSC; Type: Thick Film Resistors; Tolerance: ±1%; Temperature Coefficient: ±100ppm/℃; Operating Temperature Range: -55℃~+155℃; Check: true
R34 R35 R37 R41 R42 = 0402WGF1002TCE: Type:Thick Film Resistor Resistance:10kΩ Tolerance:±1% Tolerance:±1% Power(Watts):62.5mW Voltage-Supply(Max):50V Temperature Coefficient:±100ppm/℃ Temperature Coefficient:±100ppm/℃ Operating Temperature:-55℃~+155℃ Operating Temperature:-55℃~+155℃; LCSC Part Name: 10kΩ ±1% 62.5mW 厚膜电阻; Supplier Part: C25744; Manufacturer: UNI-ROYAL(厚声); Supplier Footprint: 0402; JLCPCB Part Class: Basic Part; Datasheet: https://item.szlcsc.com/datasheet/0402WGF1002TCE/26487.html; Supplier: LCSC; Type: Thick Film Resistor; Tolerance: ±1%; Power(Watts): 62.5mW; Voltage-Supply(Max): 50V; Temperature Coefficient: ±100ppm/℃; Operating Temperature: -55℃~+155℃
R38 R50 = RC0402FR-07100KL: Type:Thick Film Resistor Resistance:100kΩ Tolerance:±1% Tolerance:±1% Power(Watts):62.5mW Voltage-Supply(Max):50V Temperature Coefficient:±100ppm/℃ Temperature Coefficient:±100ppm/℃ Operating Temperature:-55℃~+155℃ Operating Temperature:-55℃~+155℃; LCSC Part Name: 厚膜电阻 100kΩ ±1% 62.5mW; Supplier Part: C60491; Manufacturer: YAGEO(国巨); Supplier Footprint: 0402; JLCPCB Part Class: Extended Part; Datasheet: https://atta.szlcsc.com/upload/public/pdf/source/20250610/89E4D743C004A82A45145C7A2CC3A578.pdf; Supplier: LCSC; Type: Thick Film Resistor; Tolerance: ±1%; Power(Watts): 62.5mW; Voltage-Supply(Max): 50V; Temperature Coefficient: ±100ppm/℃; Operating Temperature: -55℃~+155℃
R52 R53 = 0402WGF2000TCE: Type:Thick Film Resistor Resistance:200Ω Tolerance:±1% Tolerance:±1% Power(Watts):62.5mW Voltage-Supply(Max):50V Temperature Coefficient:±100ppm/℃ Temperature Coefficient:±100ppm/℃ Operating Temperature:-55℃~+155℃ Operating Temperature:-55℃~+155℃; LCSC Part Name: 200Ω ±1% 62.5mW 厚膜电阻; Supplier Part: C25087; Manufacturer: UNI-ROYAL(厚声); Supplier Footprint: 0402; JLCPCB Part Class: Basic Part; Datasheet: https://item.szlcsc.com/datasheet/0402WGF2000TCE/25830.html; Supplier: LCSC; Type: Thick Film Resistor; Tolerance: ±1%; Power(Watts): 62.5mW; Voltage-Supply(Max): 50V; Temperature Coefficient: ±100ppm/℃; Operating Temperature: -55℃~+155℃
SIM_STATUS WORK_LED = XL-1005UBC_C22355736: Illumination Color:Blue Voltage - Forward(Vf):3.3V Voltage - Forward(Vf):3.3V Power(Watts):- Forward Current:20mA Wavelength - Dominant:455nm~475nm Wavelength - Dominant:455nm~475nm Peak Wavelength:465nm Lens Color:Water Clear Luminous Intensity:240mcd Lu; Supplier Part: C22355736; Manufacturer: XINGLIGHT(成兴光); Supplier Footprint: 0402; JLCPCB Part Class: Extended Part; Datasheet: https://item.szlcsc.com/datasheet/XL-1005UBC/23787446.html; Supplier: LCSC; Illumination Color: Blue; Voltage - Forward(Vf): 3.3V; Forward Current: 20mA; Wavelength - Dominant: 455nm~475nm; Peak Wavelength: 465nm; Lens Color: Water Clear; Luminous Intensity: 240mcd; Viewing Angle: 120°; Mounting Style: op View Mount
C10 = CL31A107MQHNNNE: Capacitance:100uF Tolerance:±20% Tolerance:±20% Voltage Rating:6.3V Temperature Coefficient:X5R; LCSC Part Name: 100uF ±20% 6.3V; Supplier Part: C15008; Manufacturer: SAMSUNG(三星); Supplier Footprint: 1206; JLCPCB Part Class: Basic Part; Datasheet: https://item.szlcsc.com/datasheet/CL31A107MQHNNNE/15681.html; Supplier: LCSC; Tolerance: ±20%; Voltage Rating: 6.3V; Temperature Coefficient: X5R
C12 C13 = CL21A226MAYNNNE: Capacitance:22uF Tolerance:±20% Tolerance:±20% Voltage Rating:25V Temperature Coefficient:X5R; LCSC Part Name: 22uF ±20% 25V; Supplier Part: C602037; Manufacturer: SAMSUNG(三星); Supplier Footprint: 0805; JLCPCB Part Class: Extended Part; Datasheet: https://item.szlcsc.com/datasheet/CL21A226MAYNNNE/631473.html; Supplier: LCSC; Tolerance: ±20%; Voltage Rating: 25V; Temperature Coefficient: X5R
C17 C19 = CL21B225KAFNNNE: Capacitance:2.2uF Tolerance:±10% Tolerance:±10% Voltage Rating:25V Temperature Coefficient:X7R; LCSC Part Name: 2.2uF ±10% 25V; Supplier Part: C19110; Manufacturer: SAMSUNG(三星); Supplier Footprint: 0805; JLCPCB Part Class: Extended Part; Datasheet: https://item.szlcsc.com/datasheet/CL21B225KAFNNNE/19814.html; Supplier: LCSC; Tolerance: ±10%; Voltage Rating: 25V; Temperature Coefficient: X7R
CHRG = XL-1005UGC_C965793: Illumination Color:Emerald Green Voltage - Forward(Vf):3V Voltage - Forward(Vf):3V Power(Watts):80mW Forward Current:25mA Wavelength - Dominant:516nm~531nm Wavelength - Dominant:516nm~531nm Peak Wavelength:531nm Lens Color:Water Clear Color Temperature:-; Supplier Part: C965793; Manufacturer: XINGLIGHT(成兴光); Supplier Footprint: 0402; JLCPCB Part Class: Extended Part; Datasheet: https://item.szlcsc.com/datasheet/XL-1005UGC/1051402.html; Supplier: LCSC; Illumination Color: Emerald Green; Voltage - Forward(Vf): 3V; Power(Watts): 80mW; Forward Current: 25mA; Wavelength - Dominant: 516nm~531nm; Peak Wavelength: 531nm; Lens Color: Water Clear; Luminous Intensity: 249mcd; Viewing Angle: 120°; Mounting Style: op View Mount
D1 D10-D12 = AZ5825-01F: Supplier: LCSC; Supplier Part: C2905641; Manufacturer: TECH PUBLIC(台舟); JLCPCB Part Class: Extended Part; Check: true
F1 = SMD1206P250TF: Voltage - Max:6V Current - Max:35A Hold Current:2.5A Trip Current:5A Power Dissipation:800mW Resistance - Initial (Ri) (Min):10mΩ Resistance - Post Trip (R1) (Max):60mΩ Time to Trip(Max):2s Operating Temperature:-40℃~+85℃ Operating Temperature:-40℃~+85℃ L; LCSC Part Name: 6V 2.5A 1206自恢复; Supplier Part: C20803; Manufacturer: RUILON(瑞隆源); Supplier Footprint: 1206; JLCPCB Part Class: Extended Part; Datasheet: https://item.szlcsc.com/datasheet/SMD1206P250TF/21515.html; Supplier: LCSC; Voltage - Max: 6V; Current - Max: 35A; Hold Current: 2.5A; Trip Current: 5A; Power Dissipation: 800mW; Resistance - Initial (Ri) (Min): 10mΩ; Resistance - Post Trip (R1) (Max): 60mΩ; Time to Trip(Max): 2s; Operating Temperature: -40℃~+85℃; Length: 3.6mm; Width: 1.9mm; Height: 1mm
L1 = FXL0420-2R2-M: Inductance:2.2uH Tolerance:±20% Tolerance:±20% Current Rating:4.5A Current - Saturation(Isat):5A DC Resistance(DCR):58mΩ Type:Molded Inductor; LCSC Part Name: 2.2uH ±20% 5A; Supplier Part: C167206; Manufacturer: cjiang(长江微电); Supplier Footprint: SMD,4.2x4.4mm; JLCPCB Part Class: Extended Part; Datasheet: https://atta.szlcsc.com/upload/public/pdf/source/20250421/DC75C633ACB13F952A25DE8912719752.pdf; Supplier: LCSC; Tolerance: ±20%; Current Rating: 4.5A; Current - Saturation(Isat): 5A; DC Resistance(DCR): 58mΩ; Type: Molded Inductor
R33 = RC0402FR-07270RL: Type:Thick Film Resistors Resistance: Tolerance:±1% Tolerance:±1% Power(Watts): Overload Voltage (Max): Temperature Coefficient:±100ppm/℃ Temperature Coefficient:±100ppm/℃ Operating Temperature Range:-55℃~+155℃ Operating Temperature Range:-55℃~+155℃; LCSC Part Name: 厚膜电阻 270Ω ±1% 62.5mW; Supplier Part: C163474; Manufacturer: YAGEO(国巨); Supplier Footprint: 0402; JLCPCB Part Class: Extended Part; Datasheet: https://atta.szlcsc.com/upload/public/pdf/source/20181009/C309620_DA5935B6E1D48212CB7A533FE518B3C2.pdf; Supplier: LCSC; Type: Thick Film Resistors; Tolerance: ±1%; Temperature Coefficient: ±100ppm/℃; Operating Temperature Range: -55℃~+155℃
R36 = RMC04022.2K1%N: Resistance: Tolerance:±1% Tolerance:±1% Power(Watts):; LCSC Part Name: 2.2kΩ ±1% 62.5mW; Supplier Part: C325418; Manufacturer: Tyohm(幸亚电阻); Supplier Footprint: 0402; JLCPCB Part Class: Extended Part; Datasheet: https://atta.szlcsc.com/upload/public/pdf/source/20190115/C325956_D27151D492FFB3C9AB4A6F14FE01F30A.pdf; Supplier: LCSC; Tolerance: ±1%
U11 = BQ25895RTWR: Supplier Part: C80200; Manufacturer: TI(德州仪器); Supplier Footprint: QFN-24-EP(4x4); JLCPCB Part Class: Extended Part; Datasheet: https://www.ti.com/cn/lit/gpn/bq25895; Supplier: LCSC
USB1 = TYPE-C 16PIN 2MD(073): Connector Type:Type-C Protocol Standard:- Gender:Female Mounting Type:Surface Mount, Right Angle Number of Contacts:16P Number of Ports:1 Current Rating-Power:3A Voltage Rating:5V Connect-Disconnect Life:5,000 Cycles Supplementary Features:- Center Height; LCSC Part Name: Type-C 母 卧贴; Supplier Part: C2765186; Manufacturer: SHOU HAN(首韩); Supplier Footprint: SMD; JLCPCB Part Class: Extended Part; Datasheet: https://item.szlcsc.com/datasheet/TYPE-C%252016PIN%25202MD(073)/2901843.html; Supplier: LCSC; Connector Type: Type-C; Gender: Female; Mounting Type: Surface Mount, Right Angle; Number of Contacts: 16P; Number of Ports: 1; Current Rating-Power: 3A; Voltage Rating: 5V; Connect-Disconnect Life: 5,000 Cycles; Detection color: Black; Operating Temperature: -25℃~+85℃
USB2 = 10.0 QHHTZB6.3: Connector Type:Type-A Protocol Standard:USB 2.0 Gender:Female Mounting Type:Surface Mount, Right Angle Number of Contacts:4P Number of Ports:1 Current Rating-Power:1.5A Voltage Rating:30V Connect-Disconnect Life:5,000 Cycles Supplementary Features:- Cente; LCSC Part Name: Type-A 母 卧贴; Supplier Part: C668591; Manufacturer: SHOU HAN(首韩); Supplier Footprint: SMD; JLCPCB Part Class: Extended Part; Datasheet: https://item.szlcsc.com/datasheet/10.0%2520QHHTZB6.3/698534.html; Supplier: LCSC; Connector Type: Type-A; Protocol Standard: USB 2.0; Gender: Female; Mounting Type: Surface Mount, Right Angle; Number of Contacts: 4P; Number of Ports: 1; Current Rating-Power: 1.5A; Voltage Rating: 30V; Connect-Disconnect Life: 5,000 Cycles; Length: 10mm; Detection color: Black; Operating Temperature: -25℃~+85℃
D8 = 1N5819WS_C191023: Forward Voltage (Vf@If):600mV@1A Reverse Voltage (Vr):40V Rectified Current:1A; LCSC Part Name: 电压:40V 电流:1A; Supplier Part: C191023; Manufacturer: Hottech(合科泰); Supplier Footprint: SOD-323; JLCPCB Part Class: Basic Part; Datasheet: https://atta.szlcsc.com/upload/public/pdf/source/20220428/3CB86FD8D28D653594B4E35F9D5AEFD9.pdf; Supplier: LCSC; Forward Voltage (Vf@If): 600mV@1A; Reverse Voltage (Vr): 40V; Rectified Current: 1A
JP8 = HDMI-101S: Connector Type:HDMI-D Gender:Female Number of Pins:19P Mounting Type:Horizontal attachment Current Rating:0.3A Voltage Rating:- Operating Temperature:-40℃~+85℃ Operating Temperature:-40℃~+85℃; Supplier Part: C720620; Manufacturer: XUNPU(讯普); Supplier Footprint: SMD; JLCPCB Part Class: Extended Part; Datasheet: https://item.szlcsc.com/datasheet/HDMI-101S/763627.html; Supplier: LCSC; Connector Type: HDMI-D; Gender: Female; Number of Pins: 19P; Mounting Type: Horizontal attachment; Current Rating: 0.3A; Operating Temperature: -40℃~+85℃
R14 R20 R21 R27 = 10K: Supplier Part: C98220; Supplier: LCSC; Manufacturer Part: RC0603FR-0710KL; TOLERANCE: 5%; Manufacturer: YAGEO; Check: true
SW_SLEEP/WAKE SW_VOLUME_DOWN SW_VOLUME_UP = TS24CA: Supplier: LCSC; Supplier Part: C393942; Manufacturer: SHOU HAN(首韩); JLCPCB Part Class: Extended Part; Check: true
CARD2 = XKTF-N02-N: Card Connection Mode:Push-Push Card Type:MicroSD Card (TF Card) Connector Type:Connector and Ejector Additional Card Detection Pins:- Supplementary Features:- Height Above Board:2mm Operating Temperature:-25℃~+90℃ Operating Temperature:-25℃~+90℃; LCSC Part Name: 自弹式 MicroSD卡(TF卡) 卡座; Supplier Part: C381084; Manufacturer: XKB Connection(中国星坤); Supplier Footprint: SMD; JLCPCB Part Class: Extended Part; Datasheet: https://item.szlcsc.com/datasheet/XKTF-N02-N/353316.html; Supplier: LCSC; Card Connection Mode: Push-Push; Card Type: MicroSD Card (TF Card); Connector Type: Connector and Ejector; Height Above Board: 2mm; Operating Temperature: -25℃~+90℃
D13-D19 = LESD8D3.3CAT5G_C172409: Polarity:Bidirectional Reverse Stand-Off Voltage (Vrwm):3.3V Clamping Voltage:10V Peak Pulse Current (Ipp):9A Peak Pulse Power Dissipation (Ppp):60W Voltage - Breakdown:6.5V Reverse Leakage Current (Ir):100nA level of protection:IEC 61000-4-2 Type:ESD Jun; LCSC Part Name: 双向ESD; Supplier Part: C172409; Manufacturer: LRC(乐山无线电); Supplier Footprint: SOD-882; JLCPCB Part Class: Extended Part; Datasheet: https://item.szlcsc.com/datasheet/LESD8D3.3CAT5G/183796.html; Supplier: LCSC; Polarity: Bidirectional; Reverse Stand-Off Voltage (Vrwm): 3.3V; Clamping Voltage: 10V; Peak Pulse Current (Ipp): 9A; Peak Pulse Power Dissipation (Ppp): 60W; Voltage - Breakdown: 6.5V; Reverse Leakage Current (Ir): 100nA; level of protection: IEC 61000-4-2; Type: ESD; Junction Capacitance: 16pF
R51 = 0402WGF1001TCE: Type:Thick Film Resistor Resistance:1kΩ Tolerance:±1% Tolerance:±1% Power(Watts):62.5mW Voltage-Supply(Max):50V Temperature Coefficient:±100ppm/℃ Temperature Coefficient:±100ppm/℃ Operating Temperature:-55℃~+155℃ Operating Temperature:-55℃~+155℃; LCSC Part Name: 1kΩ ±1% 62.5mW 厚膜电阻; Supplier Part: C11702; Manufacturer: UNI-ROYAL(厚声); Supplier Footprint: 0402; JLCPCB Part Class: Basic Part; Datasheet: https://item.szlcsc.com/datasheet/0402WGF1001TCE/12256.html; Supplier: LCSC; Type: Thick Film Resistor; Tolerance: ±1%; Power(Watts): 62.5mW; Voltage-Supply(Max): 50V; Temperature Coefficient: ±100ppm/℃; Operating Temperature: -55℃~+155℃
R54 = 0402WGF4702TCE: Type:Thick Film Resistor Resistance:47kΩ Tolerance:±1% Tolerance:±1% Power(Watts):62.5mW Voltage-Supply(Max):50V Temperature Coefficient:±100ppm/℃ Temperature Coefficient:±100ppm/℃ Operating Temperature:-55℃~+155℃ Operating Temperature:-55℃~+155℃; LCSC Part Name: 47kΩ ±1% 62.5mW 厚膜电阻; Supplier Part: C25792; Manufacturer: UNI-ROYAL(厚声); Supplier Footprint: 0402; JLCPCB Part Class: Basic Part; Datasheet: https://item.szlcsc.com/datasheet/0402WGF4702TCE/26535.html; Supplier: LCSC; Type: Thick Film Resistor; Tolerance: ±1%; Power(Watts): 62.5mW; Voltage-Supply(Max): 50V; Temperature Coefficient: ±100ppm/℃; Operating Temperature: -55℃~+155℃
U12 = TPS25961DRVR: Number of Lines:1 Voltage Rating:2.7V~19V Voltage Rating:2.7V~19V Mounting Type:Surface Mount Operating temperature:-40℃~+125℃@(Tj) Operating temperature:-40℃~+125℃@(Tj); Supplier Part: C5571272; Manufacturer: TI(德州仪器); Supplier Footprint: WSON-6(2x2); JLCPCB Part Class: Extended Part; Datasheet: https://item.szlcsc.com/datasheet/TPS25961DRVR/6489651.html; Supplier: LCSC; Number of Lines: 1; Voltage Rating: 2.7V~19V; Mounting Type: Surface Mount; Operating temperature: -40℃~+125℃@(Tj)
C25 = TAJB107M010RNJ: Capacitance: Tolerance:±20% Tolerance:±20% Rated Voltage: Equivalent Series Resistance(ESR):1.4Ω@100kHz Operating Temperature:-55℃~+125℃ Operating Temperature:-55℃~+125℃; LCSC Part Name: 100uF ±20% 10V; Supplier Part: C7196; Manufacturer: Kyocera AVX; Supplier Footprint: CASE-B-3528; JLCPCB Part Class: Extended Part; Datasheet: https://atta.szlcsc.com/upload/public/pdf/source/20160107/1457707750344.pdf; Supplier: LCSC; Tolerance: ±20%; Equivalent Series Resistance(ESR): 1.4Ω@100kHz; Operating Temperature: -55℃~+125℃
C28 = FCC0402N330J500AT: Capacitance: Tolerance:±5% Tolerance:±5% Voltage Rating: Temperature Coefficient:; LCSC Part Name: 33pF ±5% 50V; Supplier Part: C5137486; Manufacturer: FOJAN(富捷); Supplier Footprint: 0402; JLCPCB Part Class: Extended Part; Datasheet: https://atta.szlcsc.com/upload/public/pdf/source/20220818/0EB3B7FB2F5648AC16609637FBA7DABE.pdf; Supplier: LCSC; Tolerance: ±5%
CARD1 = SMN-303: Supplier: LCSC; Supplier Part: C266888; Manufacturer: XUNPU(讯普); JLCPCB Part Class: Extended Part; Check: true
D5 = DT1042-04SO-7: Reverse Stand-Off Voltage (Vrwm):5V Maximum Clamping Voltage:9V Peak Pulse Power Dissipation (Ppp):55W Breakdown Voltage:6.2V Number of Lines:Four channels Operating Temperature:-55℃~+85℃@(Ta) Operating Temperature:-55℃~+85℃@(Ta) Type:ESD; Supplier Part: C460064; Manufacturer: DIODES(美台); Supplier Footprint: SOT-26; JLCPCB Part Class: Extended Part; Datasheet: https://atta.szlcsc.com/upload/public/pdf/source/20191129/C460064_2805D67BFF10BA05F1ABB14B65351125.pdf; Supplier: LCSC; Reverse Stand-Off Voltage (Vrwm): 5V; Maximum Clamping Voltage: 9V; Peak Pulse Power Dissipation (Ppp): 55W; Breakdown Voltage: 6.2V; Number of Lines: Four channels; Operating Temperature: -55℃~+85℃@(Ta); Type: ESD; Check: true
D20 D21 = ESD9M5.0ST5G: Reverse Stand-Off Voltage (Vrwm):5V Clamping Voltage:9.8V Peak Pulse Current (Ipp):1A@8/20us Voltage - Breakdown:5.8V Reverse Leakage Current (Ir):1uA Number of Channels:1 level of protection:IEC 61000-4-2 Type:ESD Junction Capacitance:2.5pF; LCSC Part Name: ESD 5V截止 峰值浪涌电流：1A@8/20us; Supplier Part: C242267; Manufacturer: onsemi(安森美); Supplier Footprint: SOD-923; JLCPCB Part Class: Extended Part; Datasheet: https://item.szlcsc.com/datasheet/ESD9M5.0ST5G/241208.html; Supplier: LCSC; Reverse Stand-Off Voltage (Vrwm): 5V; Clamping Voltage: 9.8V; Peak Pulse Current (Ipp): 1A@8/20us; Voltage - Breakdown: 5.8V; Reverse Leakage Current (Ir): 1uA; Number of Channels: 1; level of protection: IEC 61000-4-2; Type: ESD; Junction Capacitance: 2.5pF
JP7 = AS0BC21-S30BB-7H: Supplier Part: C2761344; Manufacturer: FOXCONN(富士康); Supplier Footprint: SMD,P=0.5mm,卧贴; JLCPCB Part Class: Extended Part; Datasheet: https://atta.szlcsc.com/upload/public/pdf/source/20210319/C2761342_D2293F5FD33DE8C4EE27F5BB0655C6EA.pdf; Supplier: LCSC; Check: true
L2 = BLM21PG300SN1D: Impedance @ Frequency:30Ω@100MHz Tolerance:±25% Tolerance:±25% DC Resistance(DCR):14mΩ Current Rating:4A Number of Circuits:1; LCSC Part Name: 单路 0805磁珠 阻抗30Ω@100MHz; Supplier Part: C16903; Manufacturer: muRata(村田); Supplier Footprint: 0805; JLCPCB Part Class: Extended Part; Datasheet: https://item.szlcsc.com/datasheet/BLM21PG300SN1D/17587.html; Supplier: LCSC; Impedance @ Frequency: 30Ω@100MHz; Tolerance: ±25%; DC Resistance(DCR): 14mΩ; Current Rating: 4A; Number of Circuits: 1
R43 = 0805W8F3300T5E: Type:Thick Film Resistor Resistance:330Ω Tolerance:±1% Tolerance:±1% Power(Watts):125mW Voltage-Supply(Max):150V Temperature Coefficient:±100ppm/℃ Temperature Coefficient:±100ppm/℃ Operating Temperature:-55℃~+155℃ Operating Temperature:-55℃~+155℃; LCSC Part Name: 330Ω ±1% 125mW 厚膜电阻; Supplier Part: C17630; Manufacturer: UNI-ROYAL(厚声); Supplier Footprint: 0805; JLCPCB Part Class: Basic Part; Datasheet: https://item.szlcsc.com/datasheet/0805W8F3300T5E/18318.html; Supplier: LCSC; Type: Thick Film Resistor; Tolerance: ±1%; Power(Watts): 125mW; Voltage-Supply(Max): 150V; Temperature Coefficient: ±100ppm/℃; Operating Temperature: -55℃~+155℃

## Nets
+5V: C4.2 C7.1 C8.2 C10.2 C19.2 Camera_Switch.1 D8.2(A) D12.2(A) JP1.77 JP1.79 JP1.81 JP1.83 JP1.85 JP1.87 R36.2 U1.6(VDD) U11.23(PMID) USB2.1(VCC)
GND: BATTERY3.7v1.2(GND) C1.1 C3.1 C4.1 C5.1 C7.2 C8.1 C10.1 C12.1 C13.1 C15.1 C17.1 C19.1 C20.1 C21.1 C22.1 C23.1 C24.1 C25.2 C26.2 C27.1 C28.1 Camera_Switch.4 CARD1.8(EP) CARD1.9(EP) CARD1.10(EP) CARD1.11(EP) CARD1.C5(GND) CARD2.6(VSS) CARD2.10(GND) CARD2.11(GND) CARD2.12(GND) CARD2.13(GND) D1.1(C) D5.2(VSS) D5.5(VCC) D10.1(C) D11.1(C) D12.1(C) D13.2 D14.2 D15.2 D16.2 D17.2 D18.2 D19.1 D20.2 D21.2 GND.1 JP1.1 JP1.2 JP1.7 JP1.8 JP1.13 JP1.14 JP1.22 JP1.23 JP1.32 JP1.33 JP1.42 JP1.43 JP1.52 JP1.53 JP1.59 JP1.60 JP1.65 JP1.66 JP1.71 JP1.74 JP1.98 JP2.7 JP2.8 JP2.13 JP2.14 JP2.19 JP2.20 JP2.25 JP2.26 JP2.31 JP2.32 JP2.37 JP2.38 JP2.44 JP2.50 JP2.55 JP2.56 JP2.61 JP2.62 JP2.67 JP2.68 JP2.73 JP2.74 JP2.79 JP2.80 JP2.85 JP2.86 JP2.91 JP2.92 JP2.97 JP2.98 JP3.1 JP3.2 JP3.7 JP3.13 JP3.14 JP3.17 JP3.20 JP3.23 JP4.1 JP6.4 JP6.5 JP7.3 JP7.5 JP7.11 JP7.21 JP7.27 JP7.33 JP7.39 JP7.45 JP7.51 JP7.57 JP7.69 JP7.71 JP7.73 JP7.75 JP8.4(TMDS_DATA2_SHIELD) JP8.7(TMDS_DATA1_SHIELD) JP8.10(TMDS_DATA0_SHIELD) JP8.13(TMDS_CLOCK_SHIELD) JP8.16(DDC/CEC_GND) JP8.20(SHIELD) MIC_INPUT.2(-) Mic_switch.4 Q1.2(S) R1.1 R2.1 R3.1 R7.1 R31.1 R32.1 R33.1 R35.1 R38.2 SW_SLEEP/WAKE.1 SW_SLEEP/WAKE.2 SW_SLEEP/WAKE.4 SW_VOLUME_DOWN.1 SW_VOLUME_DOWN.2 SW_VOLUME_DOWN.4 SW_VOLUME_UP.1 SW_VOLUME_UP.2 SW_VOLUME_UP.4 U1.7(GND) U11.17(PGND) U11.18(PGND) U11.25(PAD) U12.2(OVLO) U12.4(GND) U12.7(GND) USB1.1(GND) USB1.12(GND) USB1.13(SHELL) USB1.14(SHELL) USB2.4(GND) USB2.5 USB2.6
VBAT: BATTERY3.7v1.1(VCC) C23.2 U11.13(BAT) U11.14(BAT)
VCC_1V8: JP1.88 JP1.90
VCC_3V3: C20.2 JP1.84 JP1.86 Mic_switch.3 R14.1 R20.1 R21.1 R27.1 R41.2 R42.2 R50.1 R54.2 SIM_STATUS.2(A) U12.6(IN) WORK_LED.2(A)
VCC_SD: C24.2 CARD2.4(VDD) D19.2 R51.2 U12.1(OUT)
BTST: C18.2 U11.21(BTST)
CARD_DETECT: CARD1.CD JP7.66
CE: R38.1 U11.9(CE)
GPIO0_D0(UART2_RX_M0): JP1.51 R26.1
GPIO0_D1(UART2_TX_M0): JP1.55 R25.1
GPIO3_D1: JP1.25 R14.2 SW_VOLUME_DOWN.3
GPIO3_D2: JP1.27 R20.2 SW_VOLUME_UP.3
GPIO3_D4: JP1.30 JP7.6
GPIO3_D5: JP1.29 R21.2 SW_SLEEP/WAKE.3
GPIO3_D7: JP1.28 JP7.8
HDMI_CEC_PORT: JP2.51 JP8.15(CEC)
HDMI_TX0_N: JP2.84 JP8.11(TMDS_DATA0-)
HDMI_TX0_P: JP2.82 JP8.9(TMDS_DATA0+)
HDMI_TX1_N: JP2.78 JP8.8(TMDS_DATA1-)
HDMI_TX1_P: JP2.76 JP8.6(TMDS_DATA1+)
HDMI_TX2_N: JP2.72 JP8.5(TMDS_DATA2-)
HDMI_TX2_P: JP2.70 JP8.3(TMDS_DATA2+)
HDMI_TX_HPD_PORT: JP2.53 JP8.1(HOT_PLUG_DET)
HDMI_TXCLK_N: JP2.90 JP8.14(TMDS_CLOCK-)
HDMI_TXCLK_P: JP2.88 JP8.12(TMDS_CLOCK+)
HDMI_TXDDC_SCL_PORT: JP2.100 JP8.17(SCL)
HDMI_TXDDC_SDA_PORT: JP2.99 JP8.18(SDA)
HP_DET_L: C21.2 JP3.15 R50.2 R55.1 R56.1
HP_SNS: JP3.8 JP5.2 R3.2
HPL_OUT: JP3.6 JP5.4 R2.2
HPR_OUT: JP3.4 JP5.3 R1.2
ILIM: R33.2 U11.10(ILIM)
LED1#: JP7.10 R43.1
MIC1_IN: JP3.10 JP5.1 MIC_INPUT.1(+) R4.1 R9.1
MIC2_IN: JP3.12 MIC2.1
MIPI_CSI_RX_D2N: JP2.28 JP2.33
MIPI_CSI_RX_D2P: JP2.30 JP2.35
MIPI_CSI_RX_D3N: JP2.34 JP2.39
MIPI_CSI_RX_D3P: JP2.36 JP2.41
OTG: R37.2 U11.8(OTG)
PMIC_PWRON: JP1.99 WAKE.1
REGN: C15.2 R34.2 U11.22(REGN)
SARADC_VIN1: C5.2 JP1.70 R4.2 R7.2
SCL: JP1.35 R42.1 U11.5(SCL)
SDA: JP1.36 R41.1 U11.6(SDA)
SDMMC0_CLK: CARD2.5(CLK) D16.1 JP1.57
SDMMC0_CMD: CARD2.3(CMD) D15.1 JP1.62
SDMMC0_D0: CARD2.7(DAT0) D17.1 JP1.63
SDMMC0_D1: CARD2.8(DAT1) D18.1 JP1.67
SDMMC0_D2: CARD2.1(DAT2) D13.1 JP1.69
SDMMC0_D3: CARD2.2(CD/DAT3) D14.1 JP1.61
SDMMC0_DET: JP1.76 R51.1 R52.1
SPEAKER+: SPEAKER.1(+) U1.8(VO2)
SPEAKER-: R11.1 SPEAKER.2(-) U1.5(VO1)
SPK_OUT: C2.1 JP5.7
STATUS: CHRG.1(K) U11.4(STAT)
SW: C18.1 L1.1 U11.19(SW) U11.20(SW)
SYS: C12.2 C13.2 L1.2 L2.1 R37.1 U11.15(SYS) U11.16(SYS)
TS: R34.1 R35.2 U11.11(TS)
USB2_0_OTG_DM: D10.2(A) JP2.3 USB2.2(D-)
USB2_0_OTG_DP: D11.2(A) JP2.5 USB2.3(D+)
USB2_HOST2_N: JP3.9 JP6.2
USB2_HOST2_P: JP3.11 JP6.3
USB2_HOST3_N: D21.1 JP3.3 JP7.9
USB2_HOST3_P: D20.1 JP3.5 JP7.7
USIM_CLK: CARD1.C3(CLK) D5.6(I/O4) JP7.32
USIM_DATA: CARD1.C7(I/O) D5.4(I/O3) JP7.34
USIM_RST: CARD1.C2(RST) D5.3(I/O2) JP7.30
USIM_VDD: CARD1.C1(VCC) D5.1(I/O1) JP7.36
V_USB: C17.2 D1.2(A) F1.2 U11.1(VBUS)
$1N4419: JP4.3 R25.2
$1N4460: JP4.2 R26.2
$1N10023: JP1.95 R53.2
$1N11178: Q1.1(G) R53.1
$1N11221: R46.2 WORK_LED.1(K)
$1N11225: Q1.3(D) R46.1
$2N2: CAMERA_ON.1 Camera_Switch.2 JP6.1
$2N7: C3.2 U1.2(BYPASS) U1.3(IN+)
$2N10: R10.2 R11.2 U1.4(IN-)
$2N12: C1.2 R8.1 R9.2
$2N528: C2.2 R10.1
$2N1557: C22.2 Mic_switch.2 R8.2
$2N21313: JP5.8 R55.2
$2N21397: JP5.6 R56.2
$3N6118: JP7.23 R27.2 RING_IND1.1
$3N9431: R43.2 SIM_STATUS.1(K)
$3N12580: C25.1 C26.1 C27.2 C28.2 JP7.2 JP7.4 JP7.70 JP7.72 JP7.74 L2.2
$5N13102: D8.1(K) JP8.19(+5V)
$6N34185: CHRG.2(A) R36.1
$6N34537: U11.2(D+) U11.3(D–)
$6N55425: F1.1 USB1.2(VBUS) USB1.11(VBUS)
$6N55448: R32.2 USB1.4(CC1)
$6N55522: R31.2 USB1.10(CC2)
$9N699: CARD2.9(CD) R52.2
$9N2922: R54.1 U12.5(EN/UVLO)

Not connected (* = marked no-connect by the designer): Camera_Switch 3*; CARD1 C6(VPP)*; JP1 3* 4* 5* 6* 9* 10* 11* 12* 15* 16* 17* 18* 19* 20* 21* 24* 26* 31* 34* 37* 38* 39* 40* 41* 44* 45* 46* 47* 48* 49* 50* 54* 56* 58* 64* 68* 72* 73* 75* 78* 80* 82* 89* 91* 92* 93* 94* 96* 97* 100*; JP2 1* 2* 4* 6* 9* 10* 11* 12* 15* 16* 17* 18* 21* 22* 23* 24* 27* 29* 40* 42* 43* 45* 46* 47* 48* 49* 52* 54* 57* 58* 59* 60* 63* 64* 65* 66* 69* 71* 75* 77* 81* 83* 87* 89* 93* 94* 95* 96*; JP3 16* 18* 19* 21* 22* 24*; JP5 5*; JP6 6* 7*; JP7 1* 20* 22* 24* 25* 26* 28* 29* 31* 35* 37* 38* 40* 41* 42* 43* 44* 46* 47* 48* 49* 50* 52* 53* 54* 55* 56* 58* 59* 60* 61* 62* 63* 64* 65* 67* 68* 76* 77*; JP8 2(UTILITY)*; Mic_switch 1*; U1 1(SD#)*; U11 7(INT)* 12(QON)* 24(DSEL)*; U12 3(ILIM)*; USB1 3(SBU2)* 5(DN2)* 6(DP1)* 7(DN1)* 8(DP2)* 9(SBU1)*

## Notes on the sheets
sheet 1
- OPI CM4 CONNECTORS
sheet 2
- SPEAKER CIRCUIT
- HEAD PHONE CIRCUIT
- MICRO PHONE CIRCUIT
- USB2_CAMERA_CONNECTOR
sheet 3
- SIM CARD HOLDER
- SIM MODULE
- M.2 Connector
- STATUS LEDS
sheet 4
- HDMI PORT
- PUSH BUTTONS
sheet 5
- Type C Charging Port
- Power Management IC
- At 5V VBUS, REGN is 4.8V
- Labels:
  USB2_HOST2_P
  USB2_HOST2_N
- USB Type-A Receptacle
